# EasyEDA Pro project ProProject_SlimeVR AceStacks 16340_2024-07-12.epro

# Schematic AceStacks V1
Create Date: 2023-10-15; Page Name: P1; Project Name: SlimeVR AceStacks 16340; Schematic Name: AceStacks V1; Update Date: 2023-12-27; Company: 嘉立创EDA
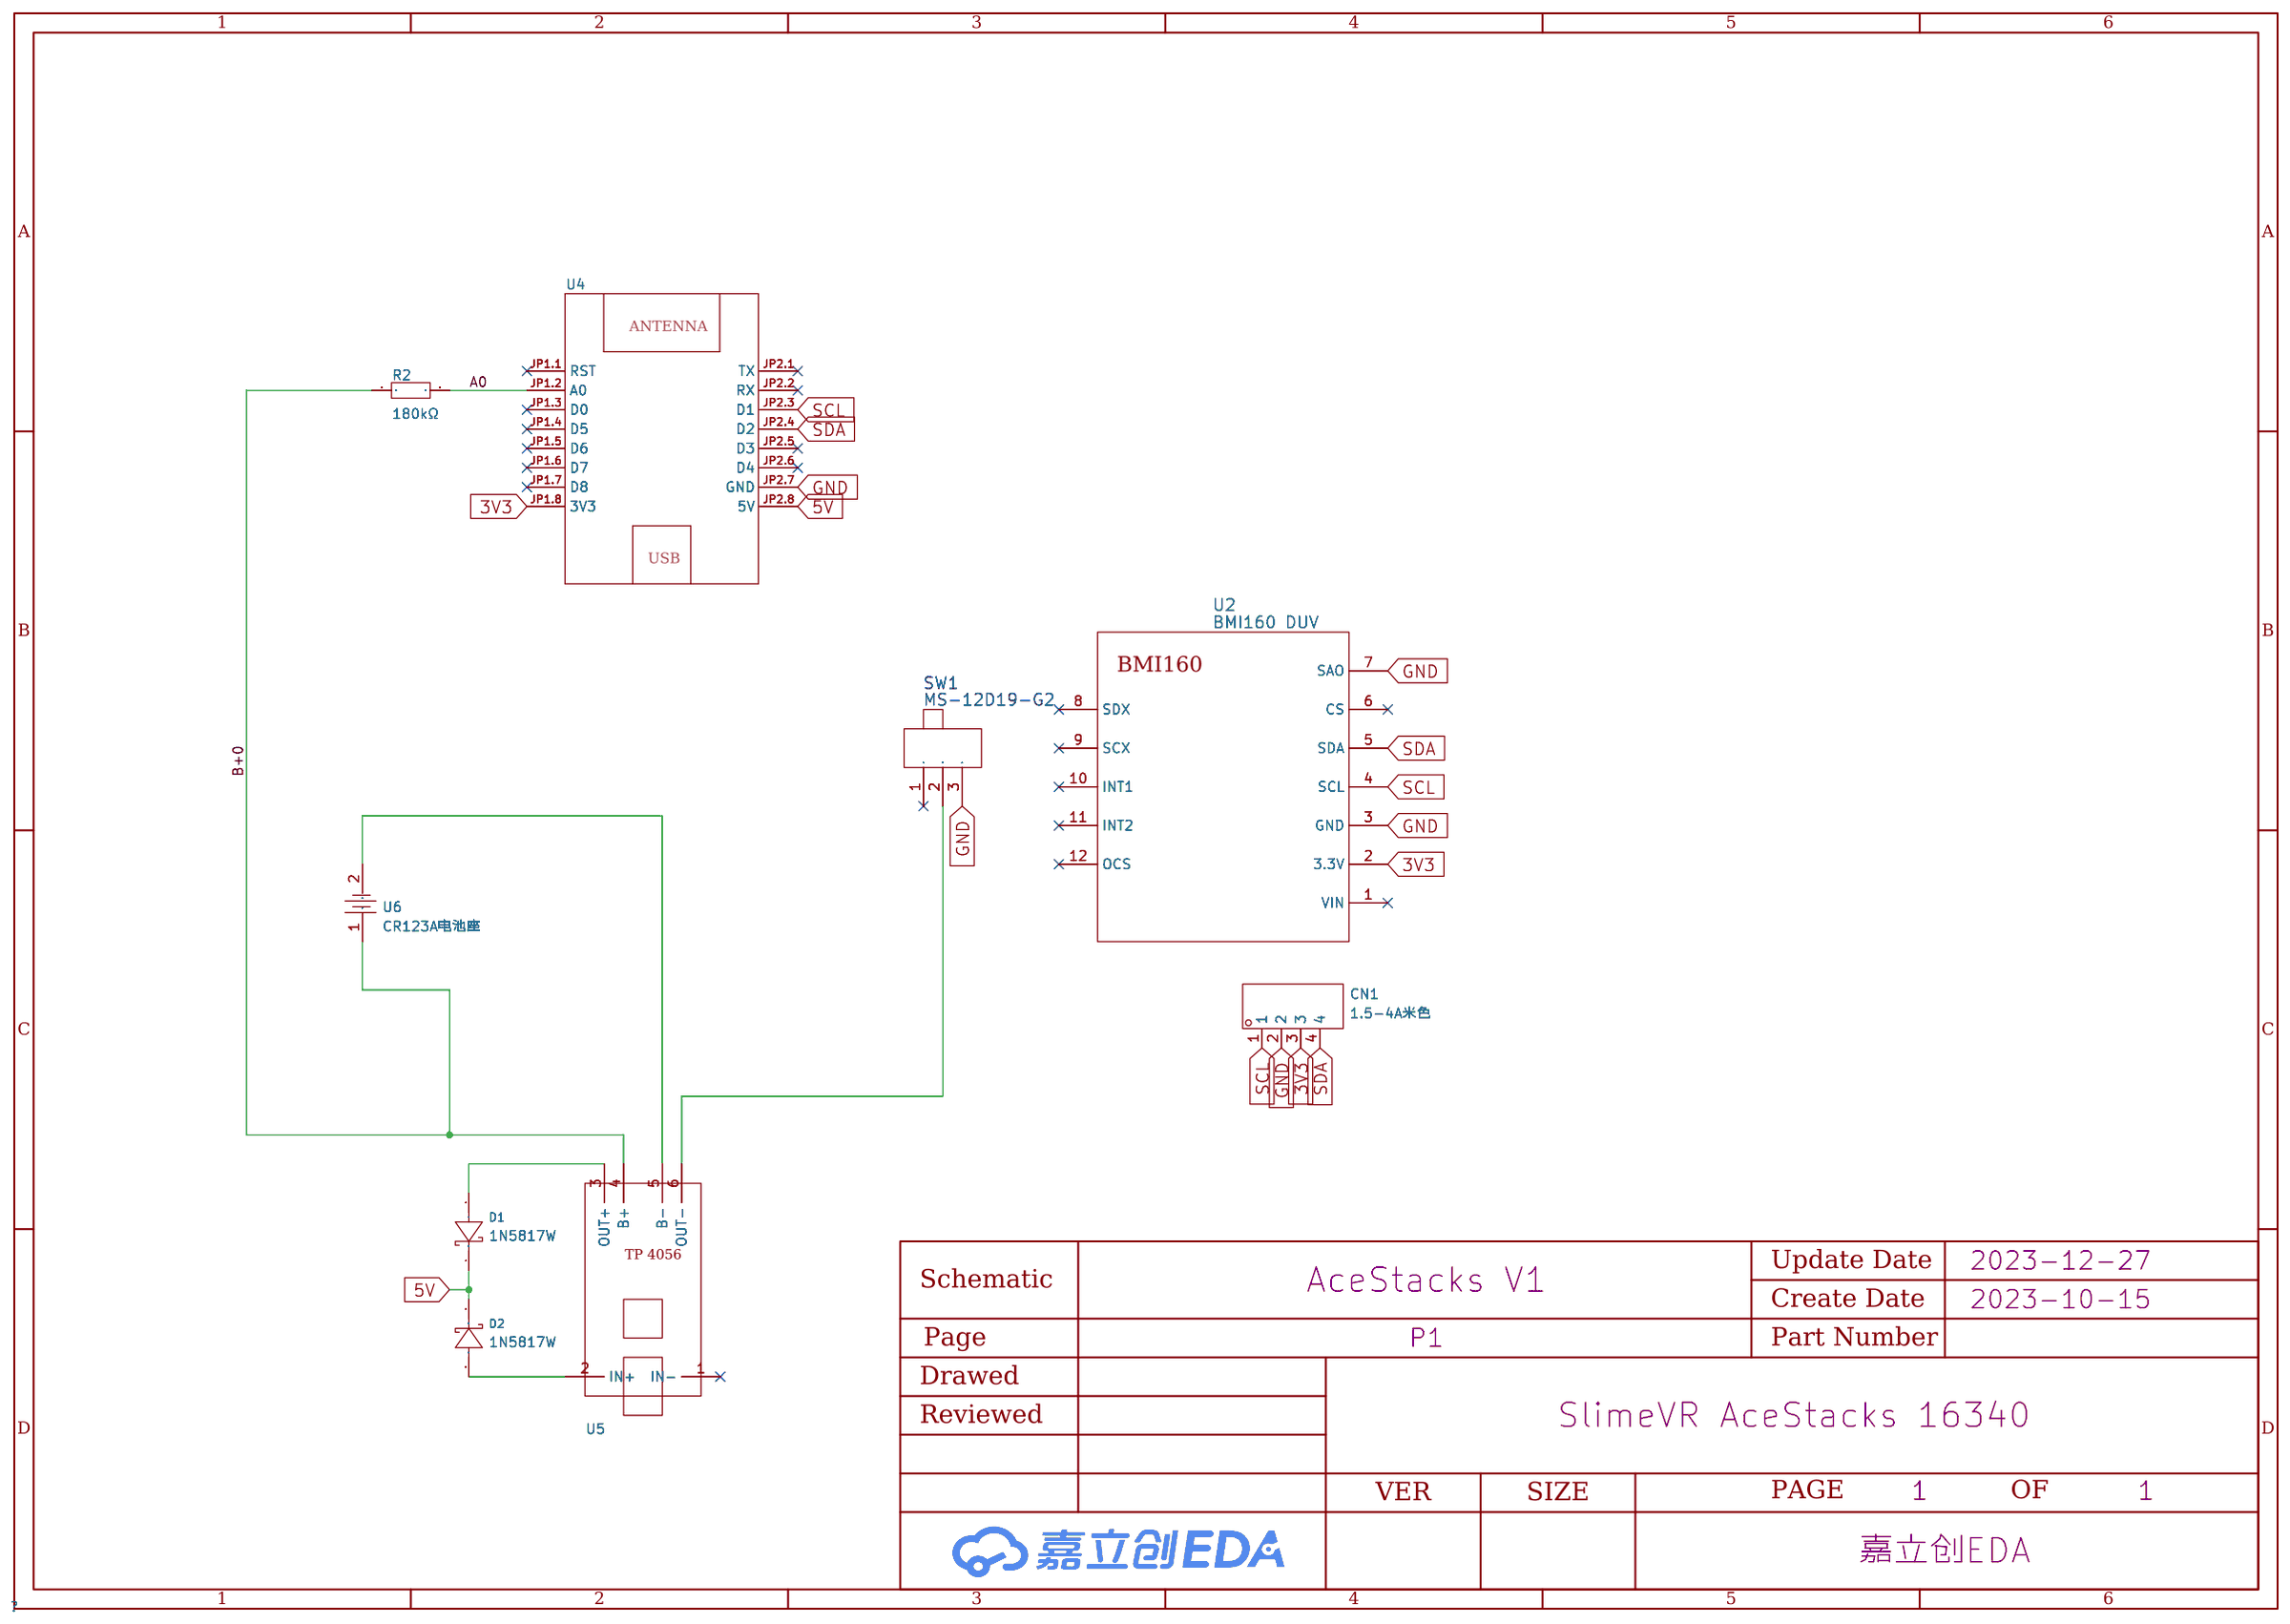
[diagram p0: schematic sheet]

## Parts
CN1  1.5-4A米色  [CONN-TH_4P-P1.50_ZH1.5-4A]
D1  1N5817W  [SOD-123_L2.8-W1.8-LS3.7-RD]
D2  1N5817W  [SOD-123_L2.8-W1.8-LS3.7-RD]
R2  180kΩ  [R1206]
SW1  MS-12D19-G2  [12d19g开关]
U2  BMI160 DUV  [GY-BMI160 DUV CORRECTED]
U4  -  [D1-MINI]
U5  -  [TP4056]
U6  CR123A电池座  [TH_L43.0-W-18.0-CR123A]

## Library data of the parts
CN1 = 1.5-4A米色: Reference Series:ZH Pitch:1.5mm Pins Structure:1x4P Number of Rows:1 Number of PINs Per Row:4 Row Spacing:- Mounting Style:- Contact Material:-; LCSC Part Name: ZH 1.5mm 1x4P; Supplier Part: C146011; Manufacturer: BOOMELE(博穆精密); Supplier Footprint: 插件,P=1.5mm; JLCPCB Part Class: Extended Part; Datasheet: https://atta.szlcsc.com/upload/public/pdf/source/20171115/C146011_15107293658451120495.pdf; Supplier: LCSC; Reference Series: ZH; Pitch: 1.5mm; Pins Structure: 1x4P; Number of Rows: 1; Number of PINs Per Row: 4
D1 D2 = 1N5817W: Diode Configuration:Single Forward Voltage (Vf@If):750mV@3A Reverse Voltage (Vr):20V Average Rectified Current (Io):1A Reverse Leakage Current (Ir):1mA@20V; LCSC Part Name: 电压:20V 电流:1A; Supplier Part: C727113; Manufacturer: TWGMC(台湾迪嘉); Supplier Footprint: SOD-123; JLCPCB Part Class: Extended Part; Datasheet: https://atta.szlcsc.com/upload/public/pdf/source/20200828/C727113_260B72EC53C389C21DF1E8AB243F1BFC.pdf; Supplier: LCSC; Diode Configuration: Single; Forward Voltage (Vf@If): 750mV@3A; Reverse Voltage (Vr): 20V; Average Rectified Current (Io): 1A; Reverse Leakage Current (Ir): 1mA@20V
R2 = Res_1206: Supplier Footprint: 1206
SW1 = MS-12D19-G2: Supplier: LCSC; Supplier Part: C2904913; Manufacturer: DEALON(德艺隆)
U2 = BMI160 DUV
U4 = D1-MINI
U5 = tp4056模块
U6 = CR123A电池座: Supplier Part: C2803347; Supplier Footprint: 插件; JLCPCB Part Class: Extended Part; Supplier: LCSC

## Nets
3V3: CN1.3 U2.2(3.3V) U4.JP1.8(3V3)
5V: D1.1(C) D2.1(C) U4.JP2.8(5V)
GND: CN1.2 SW1.3 U2.3(GND) U2.7(SAO) U4.JP2.7(GND)
A0: R2.2 U4.JP1.2(A0)
B+0: R2.1 U6.1
SCL: CN1.1 U2.4(SCL) U4.JP2.3(D1)
SDA: CN1.4 U2.5(SDA) U4.JP2.4(D2)

Not connected (* = marked no-connect by the designer): D1 2(A); D2 2(A); SW1 1* 2; U2 1(VIN)* 6(CS)* 8(SDX)* 9(SCX)* 10(INT1)* 11(INT2)* 12(OCS)*; U4 JP1.1(RST)* JP1.3(D0)* JP1.4(D5)* JP1.5(D6)* JP1.6(D7)* JP1.7(D8)* JP2.1(TX)* JP2.2(RX)* JP2.5(D3)* JP2.6(D4)*; U5 1(IN-)* 2(IN+) 3(OUT+) 4(B+) 5(B-) 6(OUT-); U6 2

# Schematic AceStacks V1_1
Create Date: 2024-02-04; Page Name: P1; Project Name: SlimeVR AceStacks 16340; Schematic Name: AceStacks V1_1; Update Date: 2024-02-21; Company: 嘉立创EDA
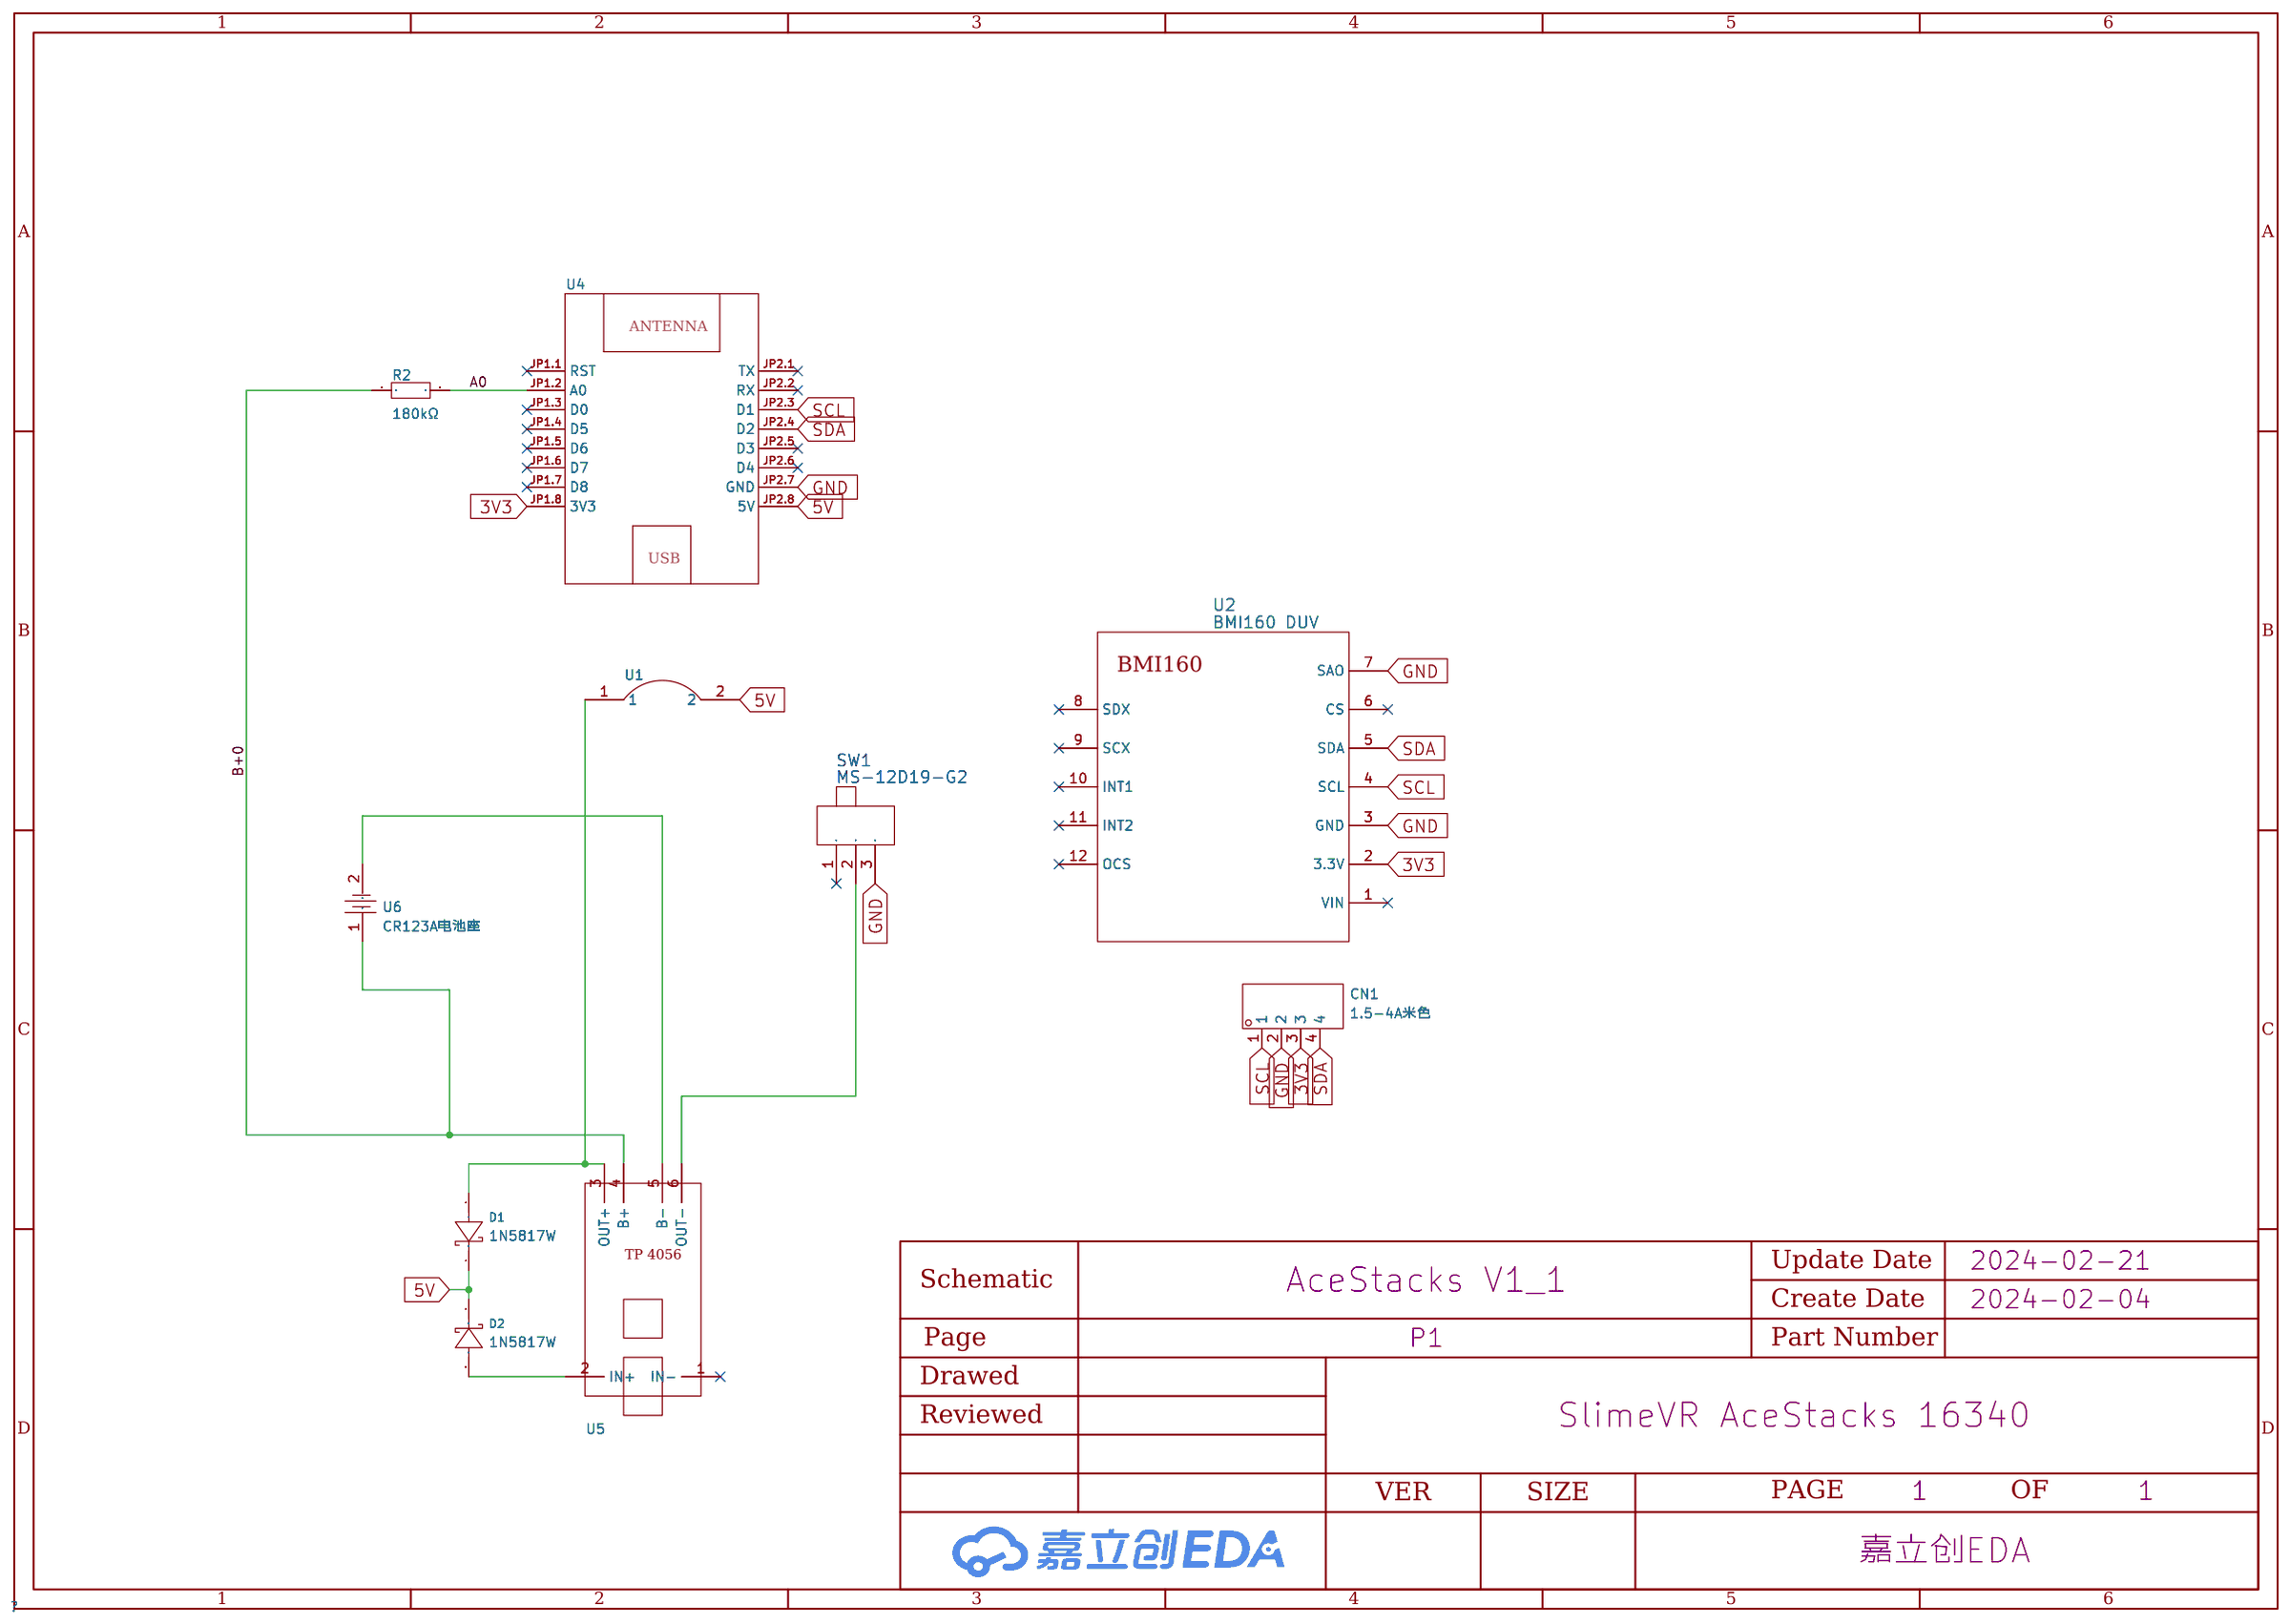
[diagram p1: schematic sheet]

## Parts
CN1  1.5-4A米色  [CONN-TH_4P-P1.50_ZH1.5-4A]
D1  1N5817W  [SOD-123_L2.8-W1.8-LS3.7-RD]
D2  1N5817W  [SOD-123_L2.8-W1.8-LS3.7-RD]
R2  180kΩ  [R1206]
SW1  MS-12D19-G2  [12d19g开关]
U1  -  [SolderJumper]
U2  BMI160 DUV  [GY-BMI160 DUV CORRECTED]
U4  -  [D1-MINI]
U5  -  [TP4056]
U6  CR123A电池座  [TH_L43.0-W-18.0-CR123A]

## Library data of the parts
CN1 = 1.5-4A米色: Reference Series:ZH Pitch:1.5mm Pins Structure:1x4P Number of Rows:1 Number of PINs Per Row:4 Row Spacing:- Mounting Style:- Contact Material:-; LCSC Part Name: ZH 1.5mm 1x4P; Supplier Part: C146011; Manufacturer: BOOMELE(博穆精密); Supplier Footprint: 插件,P=1.5mm; JLCPCB Part Class: Extended Part; Datasheet: https://atta.szlcsc.com/upload/public/pdf/source/20171115/C146011_15107293658451120495.pdf; Supplier: LCSC; Reference Series: ZH; Pitch: 1.5mm; Pins Structure: 1x4P; Number of Rows: 1; Number of PINs Per Row: 4
D1 D2 = 1N5817W: Diode Configuration:Single Forward Voltage (Vf@If):750mV@3A Reverse Voltage (Vr):20V Average Rectified Current (Io):1A Reverse Leakage Current (Ir):1mA@20V; LCSC Part Name: 电压:20V 电流:1A; Supplier Part: C727113; Manufacturer: TWGMC(台湾迪嘉); Supplier Footprint: SOD-123; JLCPCB Part Class: Extended Part; Datasheet: https://atta.szlcsc.com/upload/public/pdf/source/20200828/C727113_260B72EC53C389C21DF1E8AB243F1BFC.pdf; Supplier: LCSC; Diode Configuration: Single; Forward Voltage (Vf@If): 750mV@3A; Reverse Voltage (Vr): 20V; Average Rectified Current (Io): 1A; Reverse Leakage Current (Ir): 1mA@20V
R2 = Res_1206: Supplier Footprint: 1206
SW1 = MS-12D19-G2: Supplier: LCSC; Supplier Part: C2904913; Manufacturer: DEALON(德艺隆)
U1 = JUMPER SOLDER BRIDGE COPY COPY
U2 = BMI160 DUV
U4 = D1-MINI
U5 = tp4056模块
U6 = CR123A电池座: Supplier Part: C2803347; Supplier Footprint: 插件; JLCPCB Part Class: Extended Part; Supplier: LCSC

## Nets
3V3: CN1.3 U2.2(3.3V) U4.JP1.8(3V3)
5V: D1.1(C) D2.1(C) U1.2 U4.JP2.8(5V)
GND: CN1.2 SW1.3 U2.3(GND) U2.7(SAO) U4.JP2.7(GND)
A0: R2.2 U4.JP1.2(A0)
B+0: R2.1 U6.1
SCL: CN1.1 U2.4(SCL) U4.JP2.3(D1)
SDA: CN1.4 U2.5(SDA) U4.JP2.4(D2)
Net-(D1-2): D1.2(A) U1.1

Not connected (* = marked no-connect by the designer): D2 2(A); SW1 1* 2; U2 1(VIN)* 6(CS)* 8(SDX)* 9(SCX)* 10(INT1)* 11(INT2)* 12(OCS)*; U4 JP1.1(RST)* JP1.3(D0)* JP1.4(D5)* JP1.5(D6)* JP1.6(D7)* JP1.7(D8)* JP2.1(TX)* JP2.2(RX)* JP2.5(D3)* JP2.6(D4)*; U5 1(IN-)* 2(IN+) 3(OUT+) 4(B+) 5(B-) 6(OUT-); U6 2

# Schematic AceStacks V1_2
Create Date: 2023-10-15; Page Name: P1; Project Name: SlimeVR AceStacks 16340; Schematic Name: Kitkat SlimeVR 18650_5; Update Date: 2023-10-15; Company: 嘉立创EDA
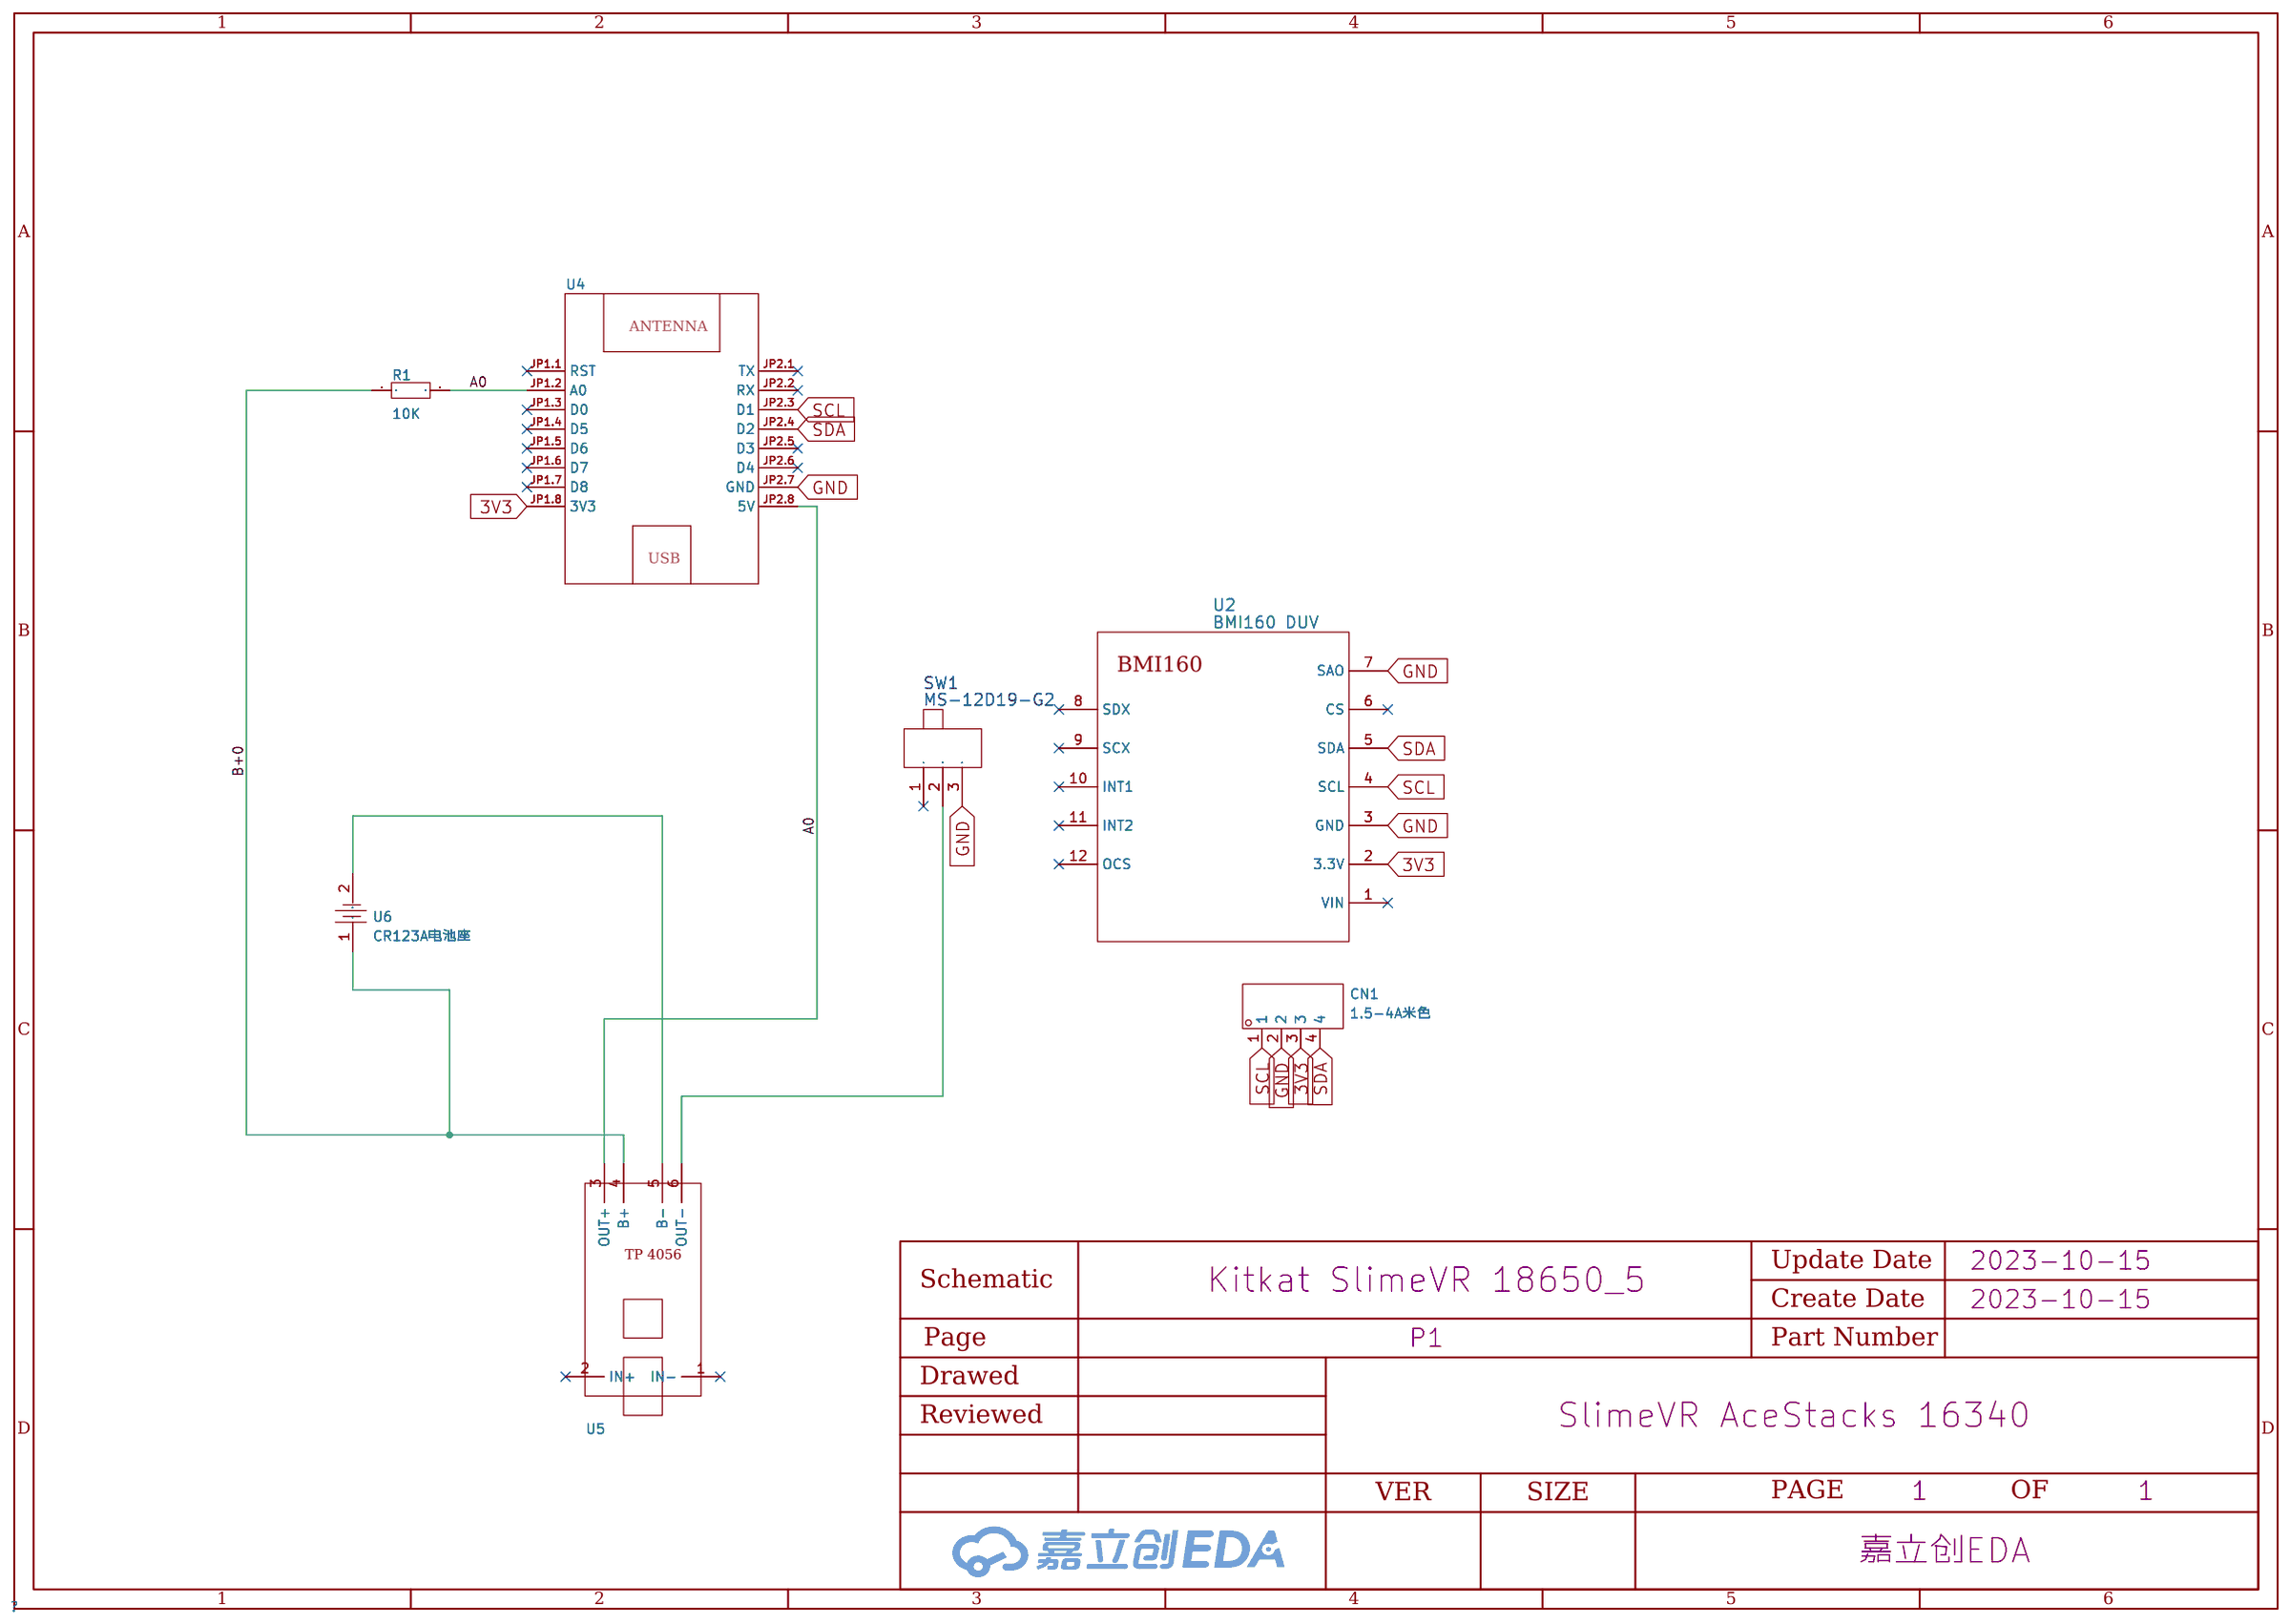
[diagram p2: schematic sheet]

## Parts
CN1  1.5-4A米色  [CONN-TH_4P-P1.50_ZH1.5-4A]
R1  10K  [R0805]
SW1  MS-12D19-G2  [12d19g开关]
U2  BMI160 DUV  [GY-BMI160 DUV CORRECTED]
U4  -  [D1-MINI]
U5  -  [TP4056]
U6  CR123A电池座  [TH_L43.0-W-18.0-CR123A]

## Library data of the parts
CN1 = 1.5-4A米色: Reference Series:ZH Pitch:1.5mm Pins Structure:1x4P Number of Rows:1 Number of PINs Per Row:4 Row Spacing:- Mounting Style:- Contact Material:-; LCSC Part Name: ZH 1.5mm 1x4P; Supplier Part: C146011; Manufacturer: BOOMELE(博穆精密); Supplier Footprint: 插件,P=1.5mm; JLCPCB Part Class: Extended Part; Datasheet: https://atta.szlcsc.com/upload/public/pdf/source/20171115/C146011_15107293658451120495.pdf; Supplier: LCSC; Reference Series: ZH; Pitch: 1.5mm; Pins Structure: 1x4P; Number of Rows: 1; Number of PINs Per Row: 4
R1 = Res_0805: Supplier Footprint: 0805
SW1 = MS-12D19-G2: Supplier: LCSC; Supplier Part: C2904913; Manufacturer: DEALON(德艺隆)
U2 = BMI160 DUV
U4 = D1-MINI
U5 = tp4056模块
U6 = CR123A电池座: Supplier Part: C2803347; Supplier Footprint: 插件; JLCPCB Part Class: Extended Part; Supplier: LCSC

## Nets
3V3: CN1.3 U2.2(3.3V) U4.JP1.8(3V3)
GND: CN1.2 SW1.3 U2.3(GND) U2.7(SAO) U4.JP2.7(GND)
A0: R1.2 U4.JP1.2(A0) U4.JP2.8(5V) U5.3(OUT+)
B+0: R1.1 U5.4(B+) U6.1
SCL: CN1.1 U2.4(SCL) U4.JP2.3(D1)
SDA: CN1.4 U2.5(SDA) U4.JP2.4(D2)
Net-(SW1-2): SW1.2 U5.6(OUT-)
Net-(U5-5): U5.5(B-) U6.2

Not connected (* = marked no-connect by the designer): SW1 1*; U2 1(VIN)* 6(CS)* 8(SDX)* 9(SCX)* 10(INT1)* 11(INT2)* 12(OCS)*; U4 JP1.1(RST)* JP1.3(D0)* JP1.4(D5)* JP1.5(D6)* JP1.6(D7)* JP1.7(D8)* JP2.1(TX)* JP2.2(RX)* JP2.5(D3)* JP2.6(D4)*; U5 1(IN-)* 2(IN+)*

# Schematic AceStacks V1_3
Create Date: 2024-02-21; Page Name: P1; Project Name: SlimeVR AceStacks 16340; Schematic Name: AceStacks V1_3; Update Date: 2024-02-21; Company: 嘉立创EDA
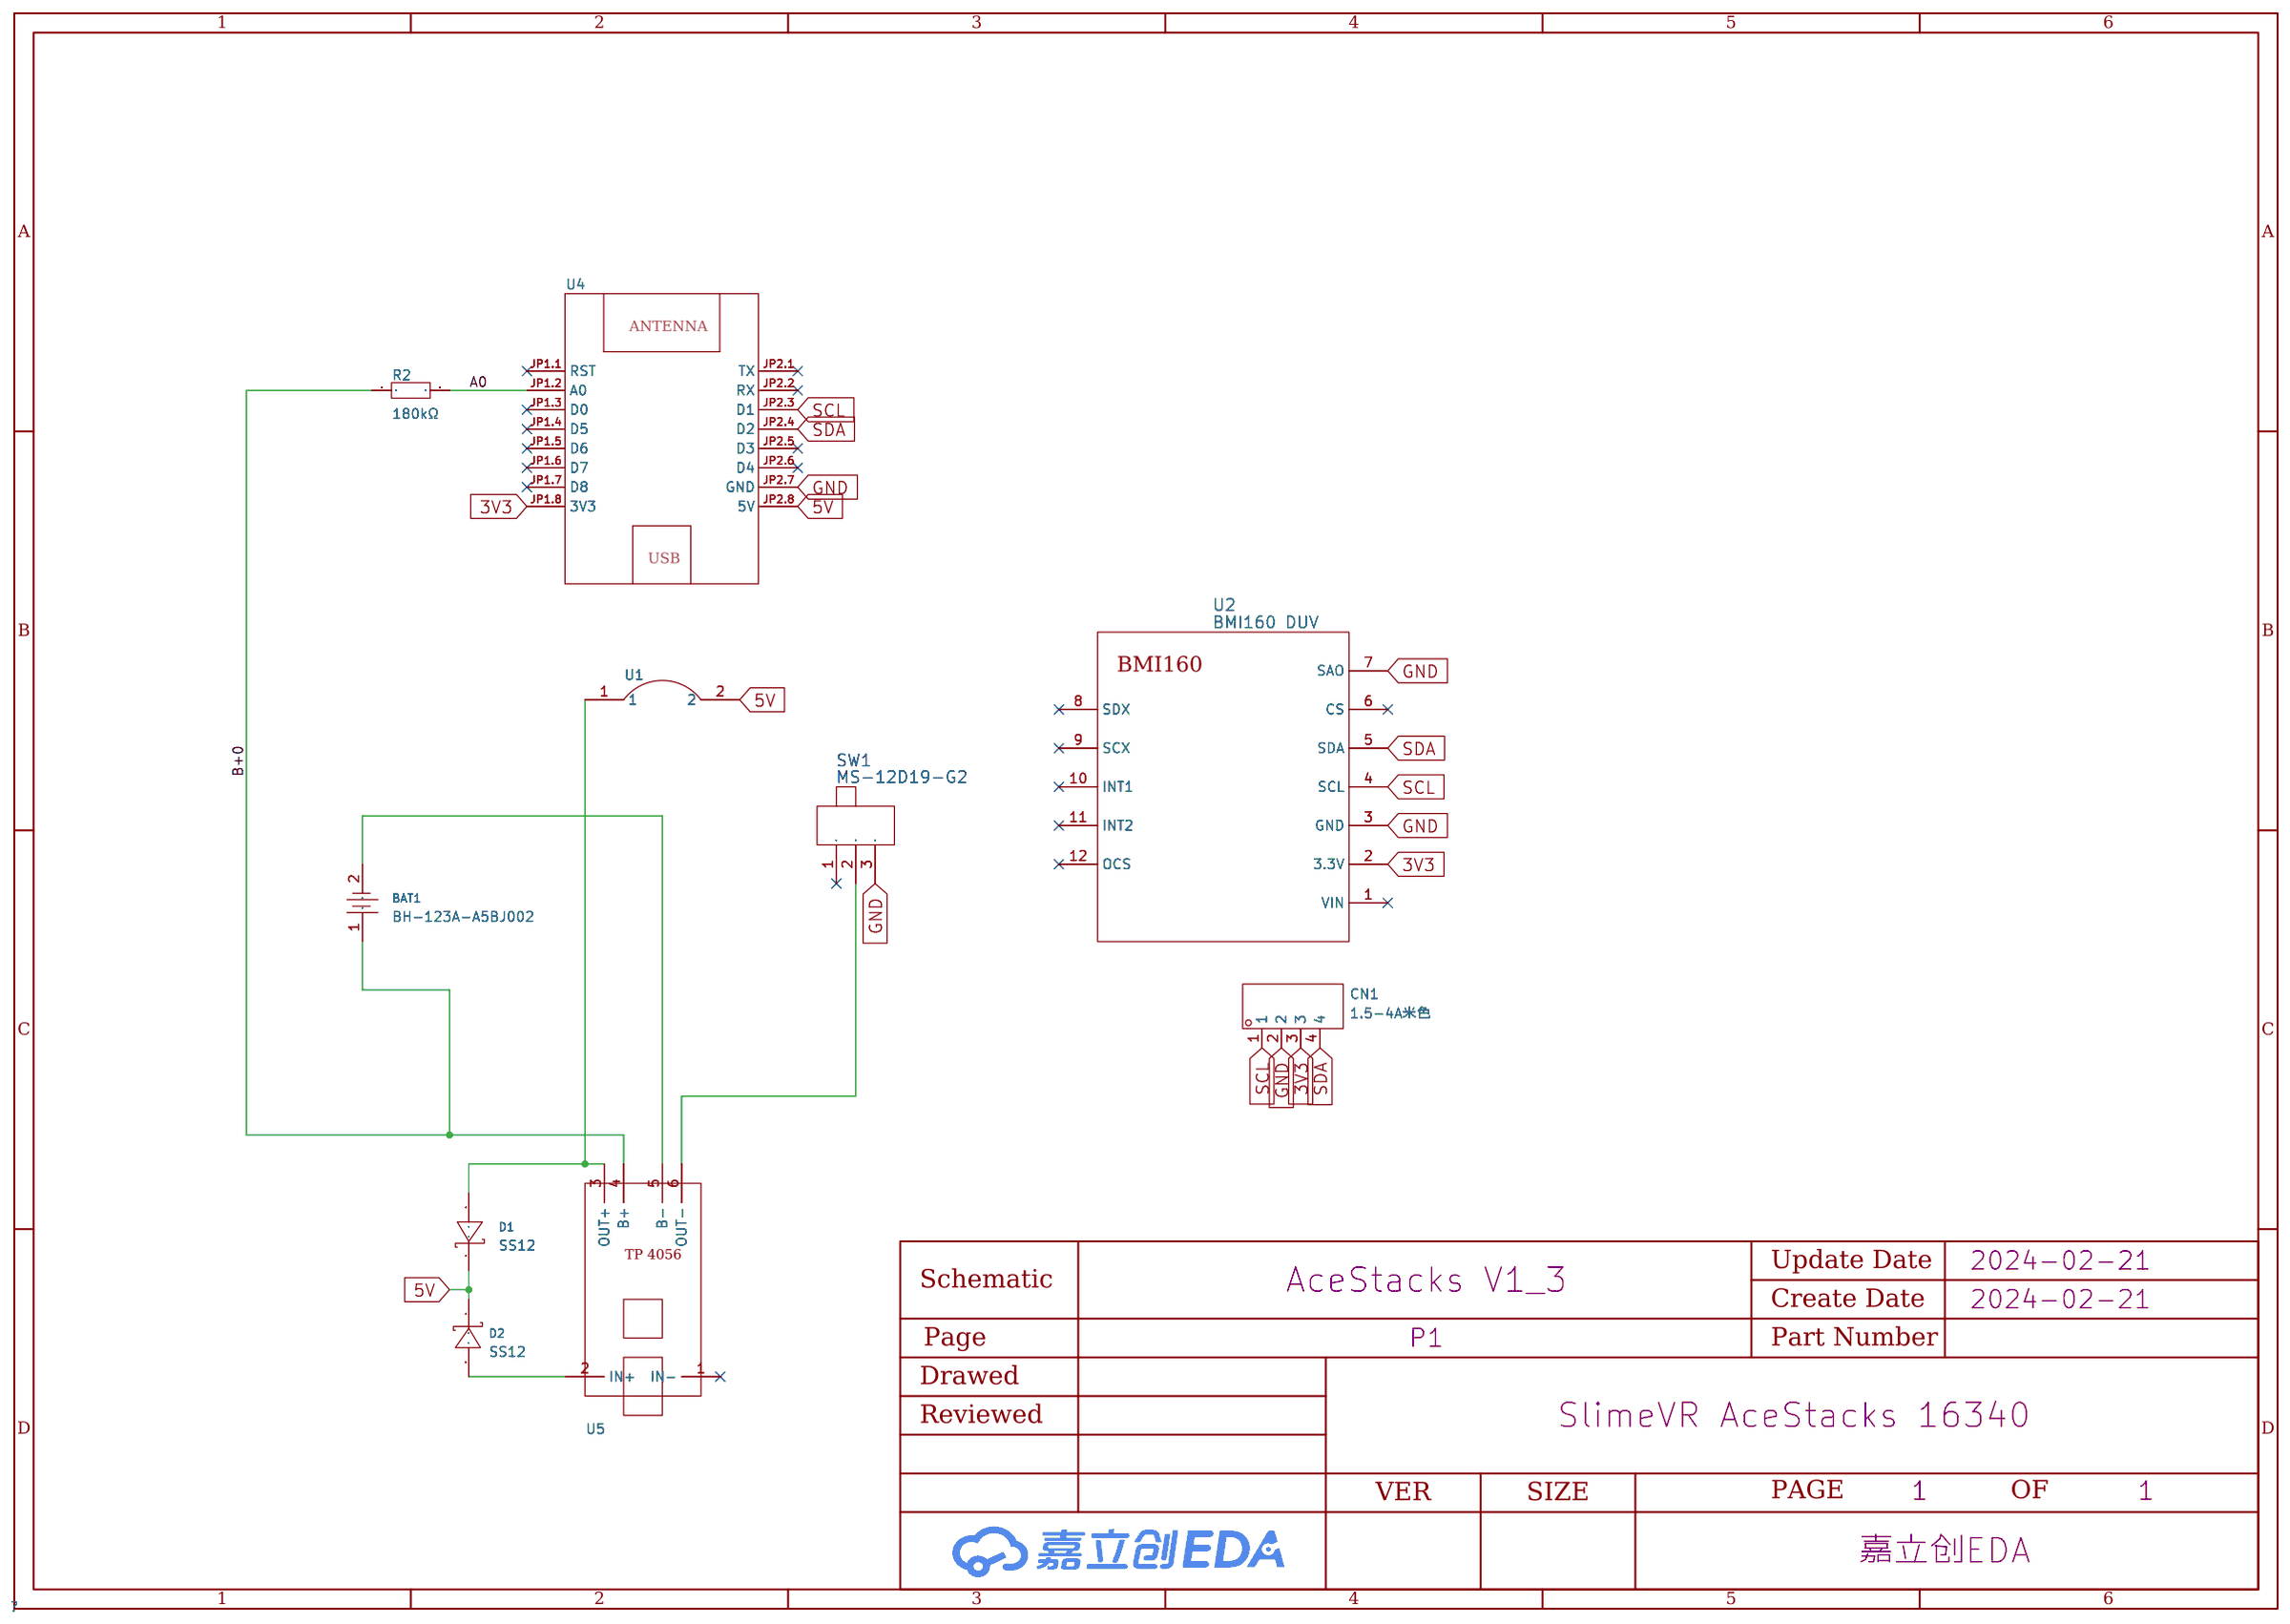
[diagram p3: schematic sheet]

## Parts
BAT1  BH-123A-A5BJ002  [BAT-TH_BH-123A-A5BJ002]
CN1  1.5-4A米色  [CONN-TH_4P-P1.50_ZH1.5-4A]
D1  SS12  [SMA_L4.3-W2.6-LS5.2-RD]
D2  SS12  [SMA_L4.3-W2.6-LS5.2-RD]
R2  180kΩ  [R1206]
SW1  MS-12D19-G2  [12d19g开关]
U1  -  [SolderJumper]
U2  BMI160 DUV  [GY-BMI160 DUV CORRECTED]
U4  -  [D1-MINI]
U5  -  [TP4056]

## Library data of the parts
BAT1 = BH-123A-A5BJ002: Connector Type:Battery case Battery Type:CR123A; LCSC Part Name: 电池盒 适用电池:CR123A; Supplier Part: C5290177; Manufacturer: MYOUNG(美阳); JLCPCB Part Class: Extended Part; Datasheet: https://atta.szlcsc.com/upload/public/pdf/source/20221129/C5DF5AE490C9EB9192DFF104AFD36393.pdf; Supplier: LCSC; Connector Type: Battery case; Battery Type: CR123A
CN1 = 1.5-4A米色: Reference Series:ZH Pitch:1.5mm Pins Structure:1x4P Number of Rows:1 Number of PINs Per Row:4 Row Spacing:- Mounting Style:- Contact Material:-; LCSC Part Name: ZH 1.5mm 1x4P; Supplier Part: C146011; Manufacturer: BOOMELE(博穆精密); Supplier Footprint: 插件,P=1.5mm; JLCPCB Part Class: Extended Part; Datasheet: https://atta.szlcsc.com/upload/public/pdf/source/20171115/C146011_15107293658451120495.pdf; Supplier: LCSC; Reference Series: ZH; Pitch: 1.5mm; Pins Structure: 1x4P; Number of Rows: 1; Number of PINs Per Row: 4
D1 D2 = SS12_C2479: Forward Voltage (Vf@If):550mV@1A Reverse Voltage (Vr):20V Average Rectified Current (Io):1A; LCSC Part Name: 电压:20V 电流:1A; Supplier Part: C2479; Manufacturer: MDD; Supplier Footprint: SMA(DO-214AC); JLCPCB Part Class: Extended Part; Datasheet: https://atta.szlcsc.com/upload/public/pdf/source/20230314/CB2C302F91CEFB8A73D1DF7B261C7D58.pdf; Supplier: LCSC; Forward Voltage (Vf@If): 550mV@1A; Reverse Voltage (Vr): 20V; Average Rectified Current (Io): 1A
R2 = Res_1206: Supplier Footprint: 1206
SW1 = MS-12D19-G2: Supplier: LCSC; Supplier Part: C2904913; Manufacturer: DEALON(德艺隆)
U1 = JUMPER SOLDER BRIDGE COPY COPY
U2 = BMI160 DUV
U4 = D1-MINI
U5 = tp4056模块

## Nets
3V3: CN1.3 U2.2(3.3V) U4.JP1.8(3V3)
5V: D1.1(K) D2.1(K) U1.2 U4.JP2.8(5V)
GND: CN1.2 SW1.3 U2.3(GND) U2.7(SAO) U4.JP2.7(GND)
A0: R2.2 U4.JP1.2(A0)
B+0: BAT1.1 R2.1
SCL: CN1.1 U2.4(SCL) U4.JP2.3(D1)
SDA: CN1.4 U2.5(SDA) U4.JP2.4(D2)
Net-(D1-2): D1.2(A) U1.1

Not connected (* = marked no-connect by the designer): BAT1 2; D2 2(A); SW1 1* 2; U2 1(VIN)* 6(CS)* 8(SDX)* 9(SCX)* 10(INT1)* 11(INT2)* 12(OCS)*; U4 JP1.1(RST)* JP1.3(D0)* JP1.4(D5)* JP1.5(D6)* JP1.6(D7)* JP1.7(D8)* JP2.1(TX)* JP2.2(RX)* JP2.5(D3)* JP2.6(D4)*; U5 1(IN-)* 2(IN+) 3(OUT+) 4(B+) 5(B-) 6(OUT-)

# Schematic AceStacksSMD
Create Date: 2023-10-24; Page Name: P1; Project Name: SlimeVR AceStacks 16340; Schematic Name: AceStacksSMD; Update Date: 2024-02-11; Company: 嘉立创EDA
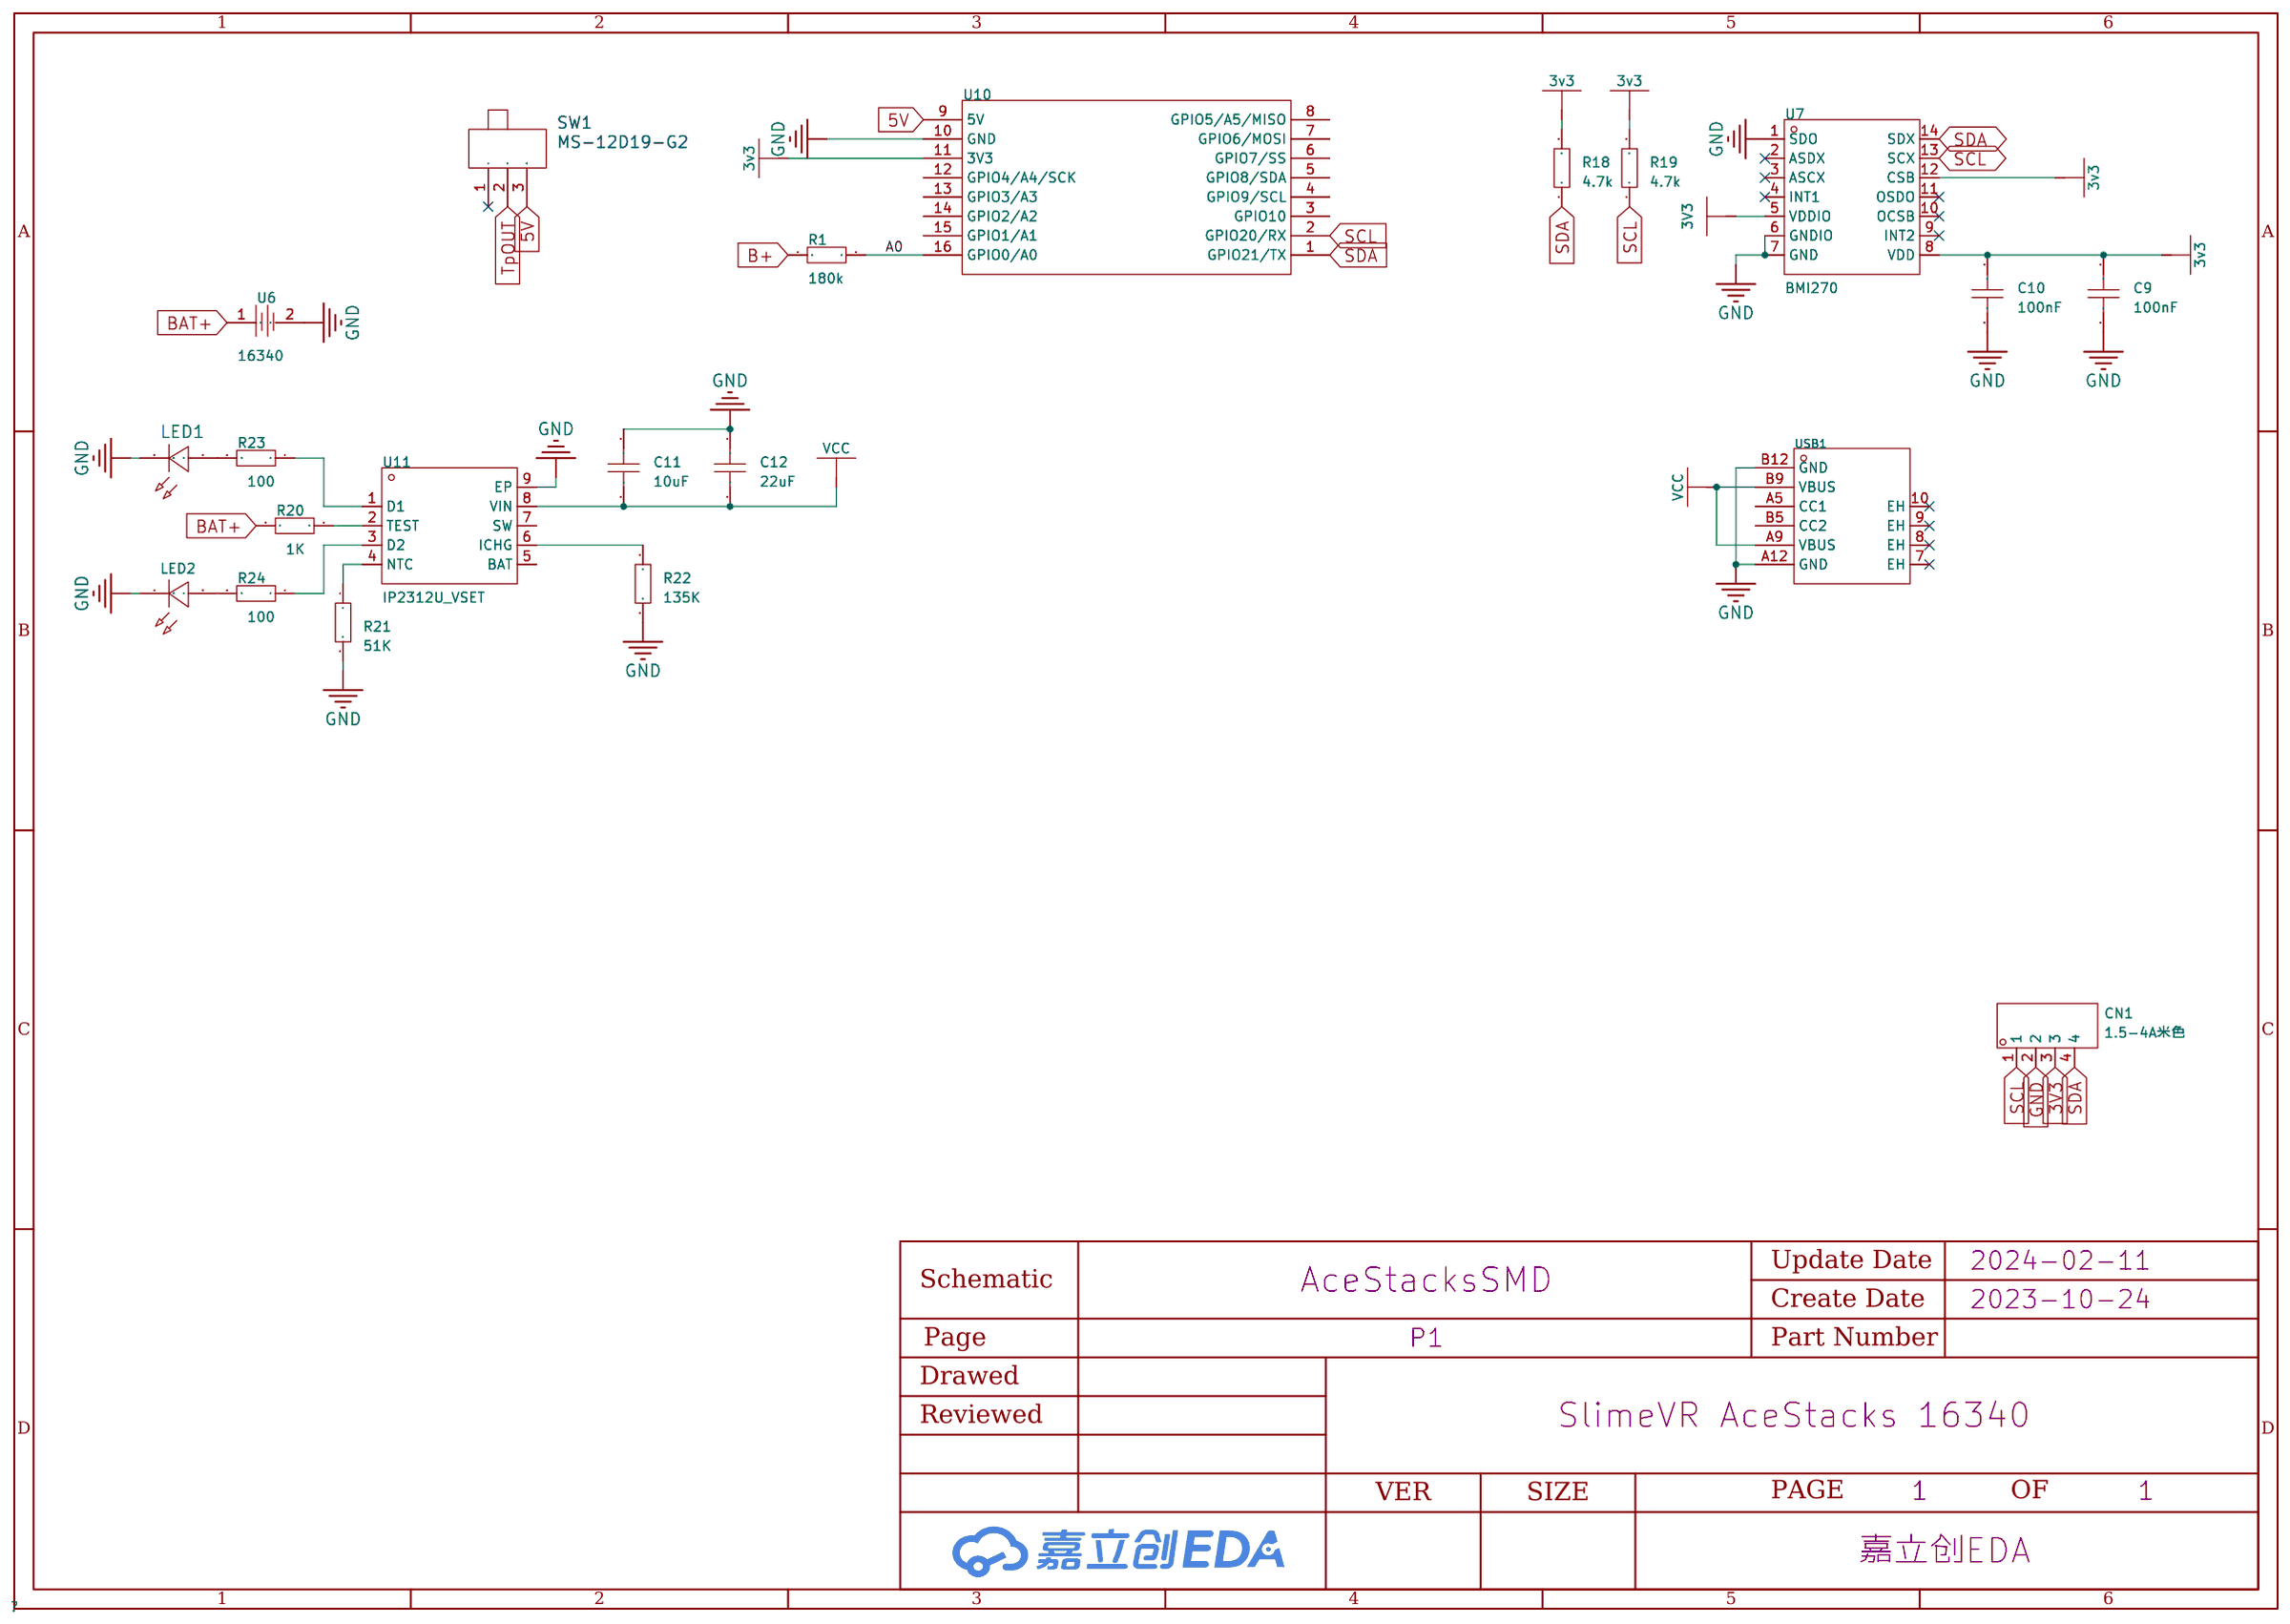
[diagram p4: schematic sheet]

## Parts
C9  100nF  [C0402]
C10  100nF  [C0402]
C11  10uF  [C0603]
C12  22uF  [C0603]
CN1  1.5-4A米色  [CONN-TH_4P-P1.50_ZH1.5-4A]
LED1  -  [LED0603-R-RD]
LED2  -  [LED0603-RD_GREEN]
R1  180k  [R0805]
R18  4.7k  [R0402]
R19  4.7k  [R0402]
R20  1K  [R0402]
R21  51K  [R0402]
R22  135K  [R0603]
R23  100  [R0402]
R24  100  [R0402]
SW1  MS-12D19-G2  [12d19g开关]
U6  16340  [TH_L43.0-W-18.0-CR123A]
U7  BMI270  [LGA-14_L3.0-W2.5-P0.50-BR]
U10  -  [ESP32-C3 SUPERMINI]
U11  IP2312U_VSET  [SOP-8_L4.9-W3.9-P1.27-LS6.0-BL-EP]
USB1  -  [USB-SMD_U262-061N-4BVC11]

## Library data of the parts
C9 C10 = CAP_0402: Supplier Part: C1525; Supplier Footprint: 0402
C11 C12 = CAP_0603: Supplier Footprint: 0603
CN1 = 1.5-4A米色: Reference Series:ZH Pitch:1.5mm Pins Structure:1x4P Number of Rows:1 Number of PINs Per Row:4 Row Spacing:- Mounting Style:- Contact Material:-; LCSC Part Name: ZH 1.5mm 1x4P; Supplier Part: C146011; Manufacturer: BOOMELE(博穆精密); Supplier Footprint: 插件,P=1.5mm; JLCPCB Part Class: Extended Part; Datasheet: https://atta.szlcsc.com/upload/public/pdf/source/20171115/C146011_15107293658451120495.pdf; Supplier: LCSC; Reference Series: ZH; Pitch: 1.5mm; Pins Structure: 1x4P; Number of Rows: 1; Number of PINs Per Row: 4
LED1 = LED_0603-R: Supplier Footprint: 0603
LED2 = LED_0603-G
R1 = Res_0805: Supplier Footprint: 0805
R18-R21 R23 R24 = Res_0402: Supplier Footprint: 0402
R22 = Res_0603: Supplier Footprint: 0603
SW1 = MS-12D19-G2: Supplier: LCSC; Supplier Part: C2904913; Manufacturer: DEALON(德艺隆)
U6 = CR123A电池座: Supplier Part: C2803347; Supplier Footprint: 插件; JLCPCB Part Class: Extended Part; Supplier: LCSC
U7 = BMI270: Supplier Part: C2836813; Manufacturer: Bosch(博世); Supplier Footprint: LGA-14(2.5x3); JLCPCB Part Class: Extended Part; Datasheet: https://atta.szlcsc.com/upload/public/pdf/source/20210625/C2836813_35E1F3F92097F45A3828DF13DDBA01A5.pdf; Supplier: LCSC
U10 = ESP32-C3 SuperMini: Supplier: AlieExpress
U11 = IP2312U_VSET: Supplier Part: C605432; Manufacturer: INJOINIC(英集芯); Supplier Footprint: SOP-8-EP; JLCPCB Part Class: Extended Part; Datasheet: https://atta.szlcsc.com/upload/public/pdf/source/20200908/C605432_A60BD6D88F2FAE4109BDCDD377258269.pdf; Supplier: LCSC
USB1 = USB_ TYPE-C-6P: Supplier Footprint: Through

## Nets
3V3: CN1.3 U7.5(VDDIO)
3v3: C9.1 C10.1 R18.2 R19.2 U7.8(VDD) U7.12(CSB) U10.11(3V3)
5V: SW1.3 U10.9(5V)
GND: C9.2 C10.2 C11.1 C12.1 CN1.2 LED1.2(C) LED2.1(C) R21.2 R22.2 U6.2 U7.1(SDO) U7.6(GNDIO) U7.7(GND) U10.10(GND) U11.9(EP) USB1.A12(GND) USB1.B12(GND)
VCC: C11.2 C12.2 U11.8(VIN) USB1.A9(VBUS) USB1.B9(VBUS)
A0: R1.2 U10.16(GPIO0/A0)
B+: R1.1
BAT+: R20.2 U6.1
SCL: CN1.1 R19.1 U7.13(SCX) U10.2(GPIO20/RX)
SDA: CN1.4 R18.1 U7.14(SDX) U10.1(GPIO21/TX)
TpOUT: SW1.2
$1N8921: R20.1 U11.2(TEST)
$1N8966: R21.1 U11.4(NTC)
$1N10747: R22.1 U11.6(ICHG)
$1N10937: LED1.1(A) R23.2
$1N10987: LED2.2(A) R24.2
$1N10991: R23.1 U11.1(D1)
$1N10995: R24.1 U11.3(D2)

Not connected (* = marked no-connect by the designer): SW1 1*; U7 2(ASDX)* 3(ASCX)* 4(INT1)* 9(INT2)* 10(OCSB)* 11(OSDO)*; U10 3(GPIO10) 4(GPIO9/SCL) 5(GPIO8/SDA) 6(GPIO7/SS) 7(GPIO6/MOSI) 8(GPIO5/A5/MISO) 12(GPIO4/A4/SCK) 13(GPIO3/A3) 14(GPIO2/A2) 15(GPIO1/A1); U11 5(BAT) 7(SW); USB1 7(EH)* 8(EH)* 9(EH)* 10(EH)* A5(CC1) B5(CC2)

# Schematic IP2312 Li-Ion Charger
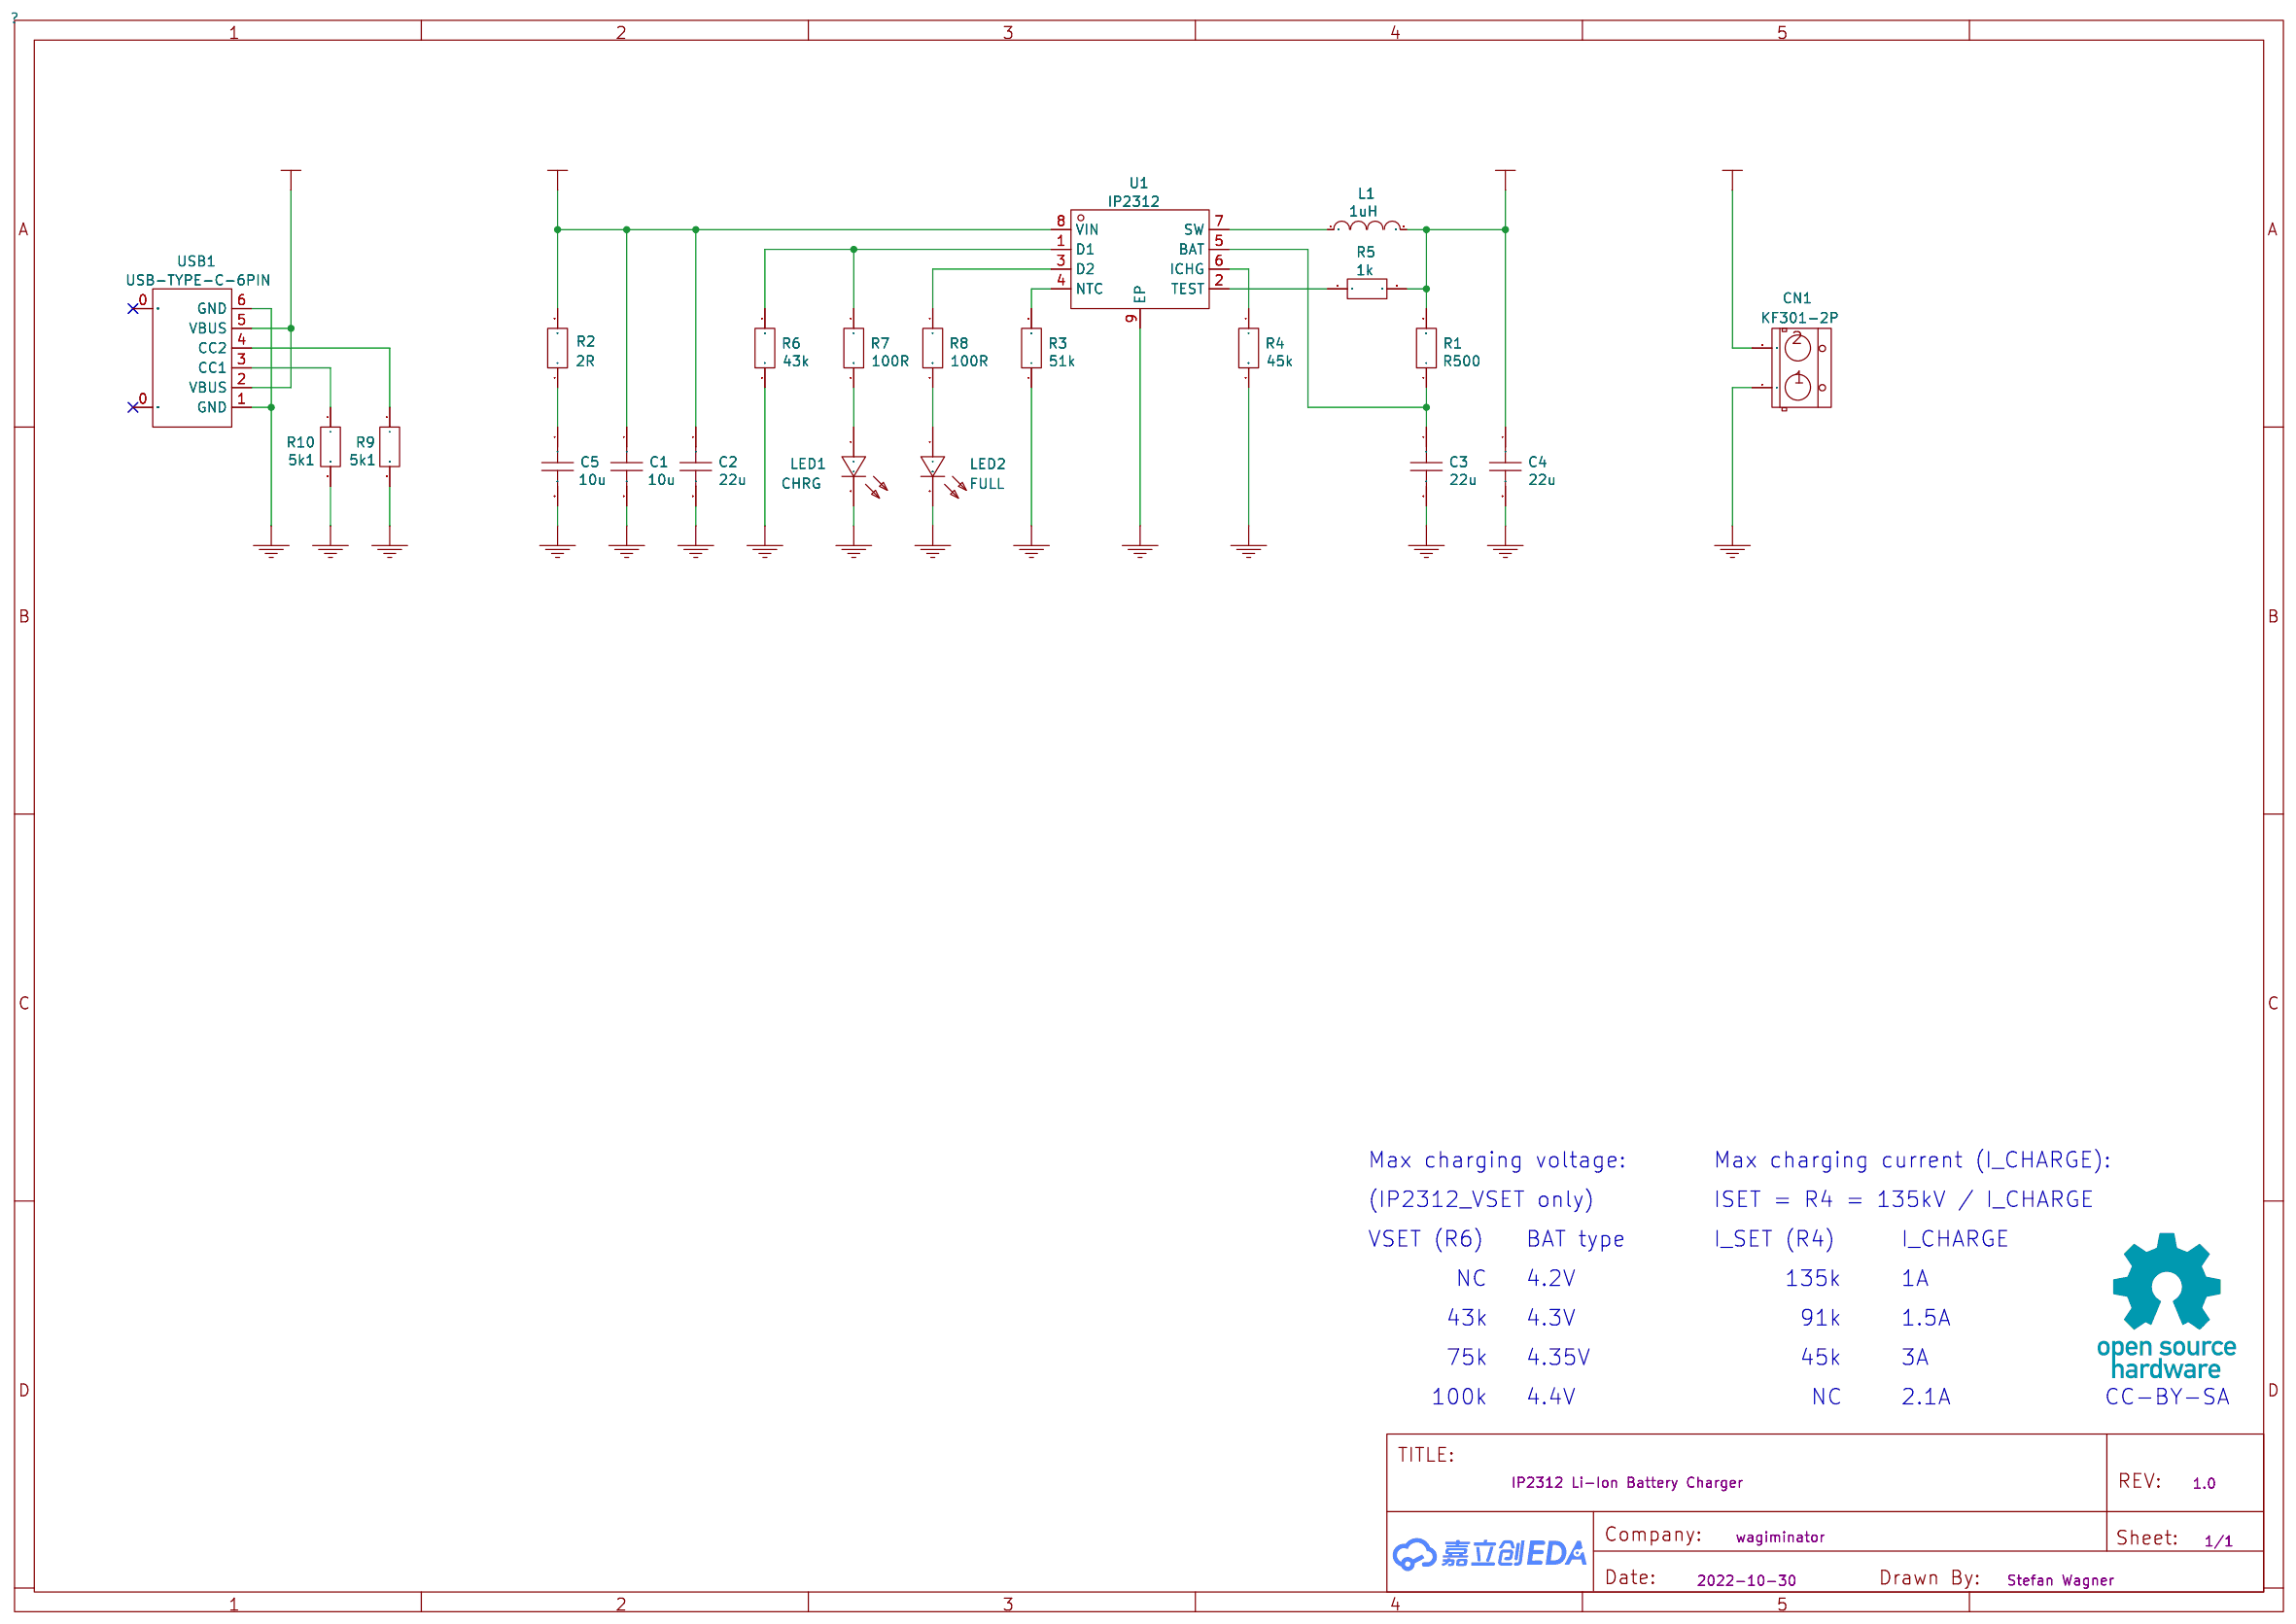
[diagram p5: schematic sheet]

## Parts
C1  10u
C2  22u
C3  22u
C4  22u
C5  10u
CN1  KF301-2P
L1  1uH
LED1  CHRG
LED2  FULL
R1  R500
R2  2R
R3  51k
R4  45k
R5  1k
R6  43k
R7  100R
R8  100R
R9  5k1
R10  5k1
U1  IP2312
USB1  USB-TYPE-C-6PIN

## Library data of the parts
C1 C5 = 10u: Supplier: LCSC; Manufacturer: SAMSUNG; Manufacturer Part: CL10A106KP8NNNC; Supplier Part: C19702; JLCPCB Part Class: Basic Part
C2-C4 = 22u: Supplier: LCSC; Manufacturer: MuRata; Manufacturer Part: GRM188R60J226MEA0D; Supplier Part: C77042; JLCPCB Part Class: Basic Part
CN1 = KF301-2P: Manufacturer Part: KF301-5.0-2P; Supplier: LCSC; Manufacturer: Cixi Kefa Elec; Supplier Part: C474881
L1 = 1uH: Supplier: LCSC; Manufacturer: Prosperity Dielectrics; Manufacturer Part: MCS0630-1R0MN2; Supplier Part: C385251
LED1 = CHRG: Supplier: LCSC; Manufacturer: KENTO; Manufacturer Part: KT-0603R; image: //image.lceda.cn/szlcsc/C2286.jpg; Supplier Part: C2286; JLCPCB Part Class: Basic
LED2 = FULL: Supplier: LCSC; Manufacturer: EVERLIGHT; Manufacturer Part: 19-217/GHC-YR1S2/3T; image: //image.lceda.cn/szlcsc/C72043.jpg; Supplier Part: C72043; JLCPCB Part Class: Basic
R1 = R500: Manufacturer Part: FRL0603JR500TS; Supplier: LCSC; Manufacturer: FOJAN; Supplier Part: C2930046
R2 = 2R: Manufacturer Part: 0603WAJ020JT5E; Supplier: LCSC; Manufacturer: UniOhm; Supplier Part: C25225
R3 = 51k: Manufacturer Part: 0603WAF5102T5E; Supplier: LCSC; Manufacturer: UniOhm; Supplier Part: C23196
R4 = 45k: Manufacturer Part: 0603WAF4532T5E; Supplier: LCSC; Manufacturer: UniOhm; Supplier Part: C23058
R5 = 1k: Manufacturer Part: 0603WAF1001T5E; Supplier: LCSC; Manufacturer: UNI-ROYAL(厚声); Supplier Part: C21190
R6 = 43k: Manufacturer Part: 0603WAF4302T5E; Supplier: LCSC; Manufacturer: UNI-ROYAL(厚声); Supplier Part: C23172
R7 R8 = 100R: Manufacturer Part: 0603WAF1000T5E; Supplier: LCSC; Manufacturer: UNI-ROYAL(厚声); Supplier Part: C22775
R9 R10 = 5k1: Manufacturer Part: 0603WAF5101T5E; Supplier: LCSC; Manufacturer: UniOhm; Supplier Part: C23186
U1 = IP2312: Supplier: LCSC; Supplier Part: C605432; Manufacturer: INJOINIC(英集芯); Manufacturer Part: IP2312U_VSET; JLCPCB Part Class: Extended Part
USB1 = USB-TYPE-C-6PIN: Supplier: LCSC; Supplier Part: C283540; Manufacturer: Korean Hroparts Elec; Manufacturer Part: TYPE-C-31-M-17

## Nets
GND: C1.2 C2.2 C3.2 C4.2 C5.2 CN1.1 LED1.2(K) LED2.2(C) R3.1 R4.2 R6.2 R9.2 R10.2 U1.9(EP) USB1.1(GND) USB1.6(GND)
VBAT: C4.1 CN1.2 L1.2 R1.2 R5.2
VIN: C1.1 C2.1 R2.2 U1.8(VIN) USB1.2(VBUS) USB1.5(VBUS)
Net-(C3-1): C3.1 R1.1 U1.5(BAT)
Net-(C5-1): C5.1 R2.1
Net-(L1-1): L1.1 U1.7(SW)
Net-(LED1-1): LED1.1(A) R7.2
Net-(LED2-1): LED2.1(A) R8.2
Net-(R3-2): R3.2 U1.4(NTC)
Net-(R4-1): R4.1 U1.6(ICHG)
Net-(R5-1): R5.1 U1.2(TEST)
Net-(R6-1): R6.1 R7.1 U1.1(D1)
Net-(R8-1): R8.1 U1.3(D2)
Net-(R9-1): R9.1 USB1.4(CC2)
Net-(R10-1): R10.1 USB1.3(CC1)

Not connected (* = marked no-connect by the designer): USB1 0(SHIELD)*

## Notes on the sheet
- Max charging voltage:
- Max charging current (I_CHARGE):
- (IP2312_VSET only)
- ISET = R4 = 135kV / I_CHARGE
- VSET (R6)
- BAT type
- I_SET (R4)
- I_CHARGE
- NC
- 4.2V
- 135k
- 1A
- 43k
- 4.3V
- 91k
- 1.5A
- 75k
- 4.35V
- 45k
- 3A
- 100k
- 4.4V
- NC
- 2.1A
- CC-BY-SA

# Schematic Kitkat SlimeVR 16340_1
Create Date: 2023-03-20; Page Name: P1; Project Name: Kitkat SlimeVR 18650; Schematic Name: Kitkat SlimeVR 18650; Update Date: 2023-08-21; Company: 嘉立创EDA
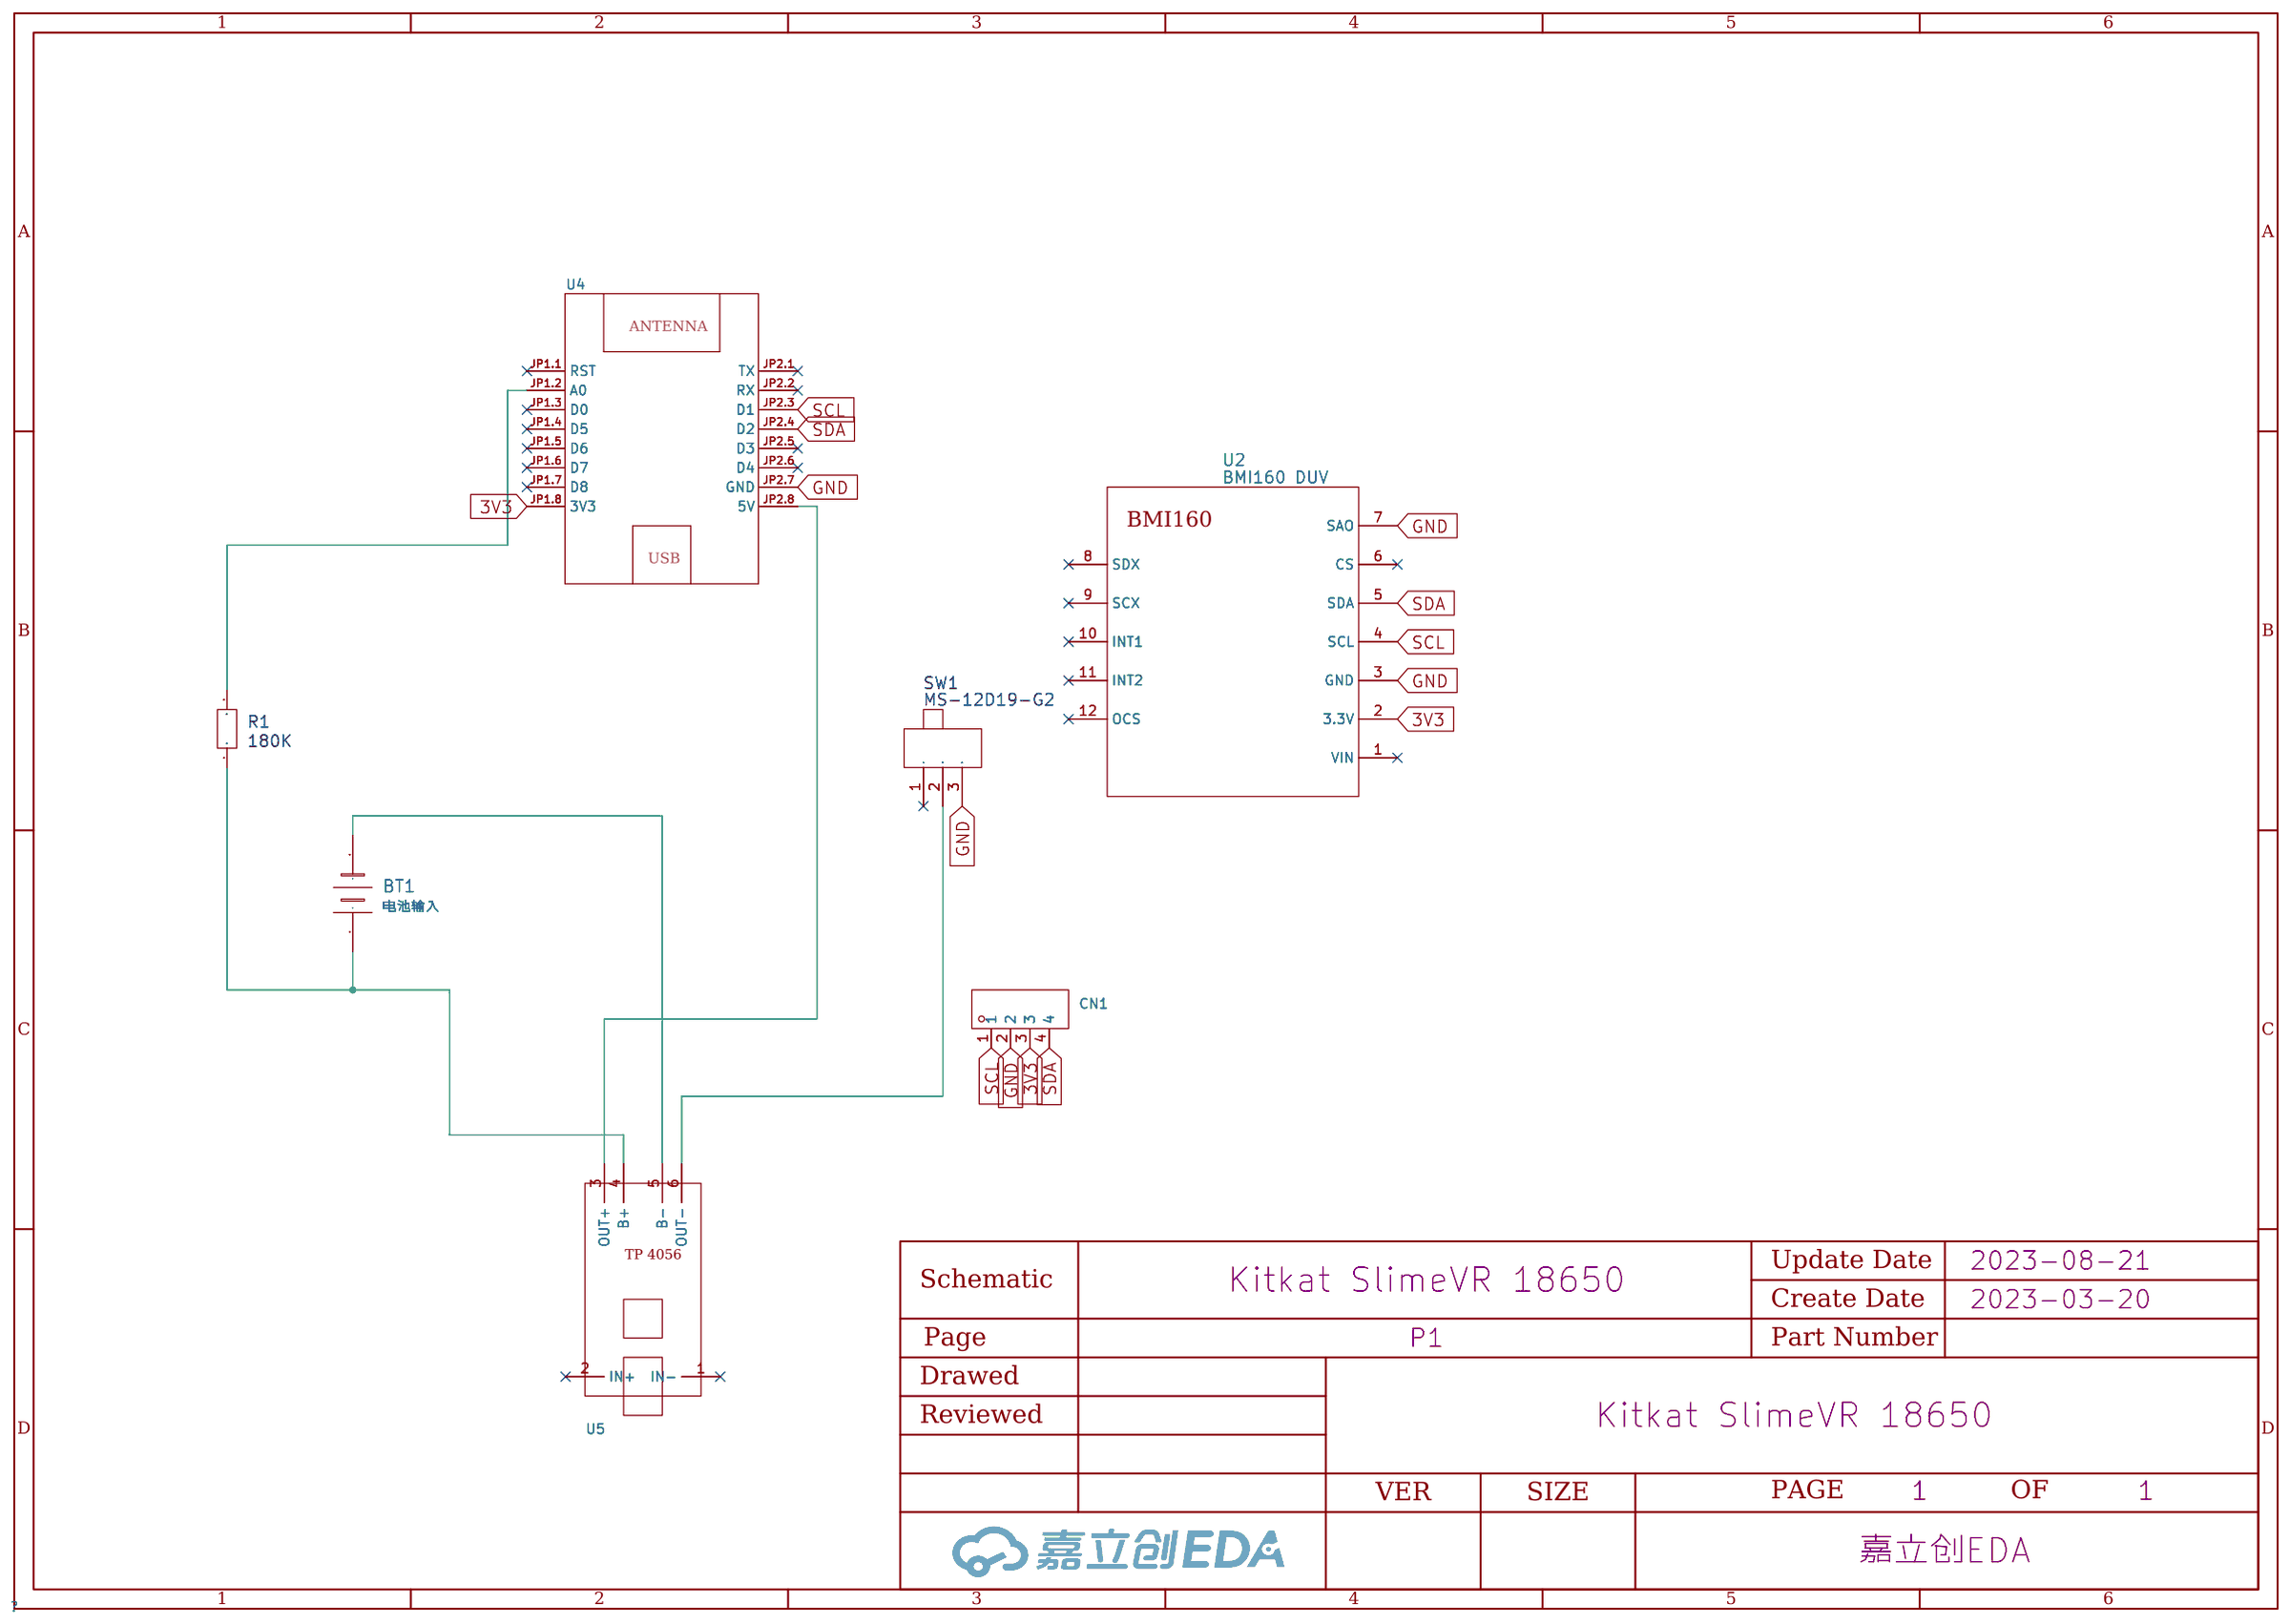
[diagram p6: schematic sheet]

## Parts
BT1  电池输入  [18650]
CN1  -  [CONN-TH_4P-P2.00_KINGHELM_KH-PH-4P-W]
R1  180K  [RES-TH_BD2.4-L6.3-P10.30-D0.6]
SW1  MS-12D19-G2  [12d19g开关]
U2  BMI160 DUV  [GY-BMI160 DUV CORRECTED]
U4  -  [D1-MINI]
U5  -  [TP4056]

## Library data of the parts
BT1 = 3.7V
CN1 = PH2.00-4P-立贴: Supplier Part: C146095; Manufacturer: BOOMELE(博穆精密); Manufacturer Part: PH-4AW米; LCSC On Sale: 1; Supplier Footprint: 卧插 P=2mm; JLCPCB Part Class: Extended Part; JLCPCB Stock Number: 4500; Datasheet: https://atta.szlcsc.com/upload/public/pdf/source/20171115/C146095_15107294042951120572.pdf; Supplier: LCSC; Number of Positions: 4; Connector Type: 针座; Number of Rows: 1; Mounting Type: 通孔,直角; Contact Type: 公形引脚; Pitch: 0.079; Series: PH
R1 = RN 1/4W 180K F T/B A1: Supplier: LCSC; Supplier Part: C410667; Manufacturer: TyoHM; JLCPCB Part Class: Extended Part; Resistance: 180kΩ
SW1 = MS-12D19-G2: Supplier: LCSC; Supplier Part: C2904913; Manufacturer: DEALON(德艺隆)
U2 = BMI160 DUV
U4 = D1-MINI
U5 = tp4056模块

## Nets
3V3: CN1.3 U2.2(3.3V) U4.JP1.8(3V3)
GND: CN1.2 SW1.3 U2.3(GND) U2.7(SAO) U4.JP2.7(GND)
SCL: CN1.1 U2.4(SCL) U4.JP2.3(D1)
SDA: CN1.4 U2.5(SDA) U4.JP2.4(D2)
$1N942: SW1.2 U5.6(OUT-)
$1N944: R1.2 U4.JP1.2(A0)
$1N945: BT1.1(+) R1.1 U5.4(B+)
$1N946: BT1.2(-) U5.5(B-)
$1N1593: U4.JP2.8(5V) U5.3(OUT+)

Not connected (* = marked no-connect by the designer): SW1 1*; U2 1(VIN)* 6(CS)* 8(SDX)* 9(SCX)* 10(INT1)* 11(INT2)* 12(OCS)*; U4 JP1.1(RST)* JP1.3(D0)* JP1.4(D5)* JP1.5(D6)* JP1.6(D7)* JP1.7(D8)* JP2.1(TX)* JP2.2(RX)* JP2.5(D3)* JP2.6(D4)*; U5 1(IN-)* 2(IN+)*

# Schematic Kitkat SlimeVR 18650_2
Create Date: 2023-09-06; Page Name: P1; Project Name: Kitkat SlimeVR 18650; Schematic Name: Kitkat SlimeVR 18650_2; Update Date: 2023-09-06; Company: 嘉立创EDA
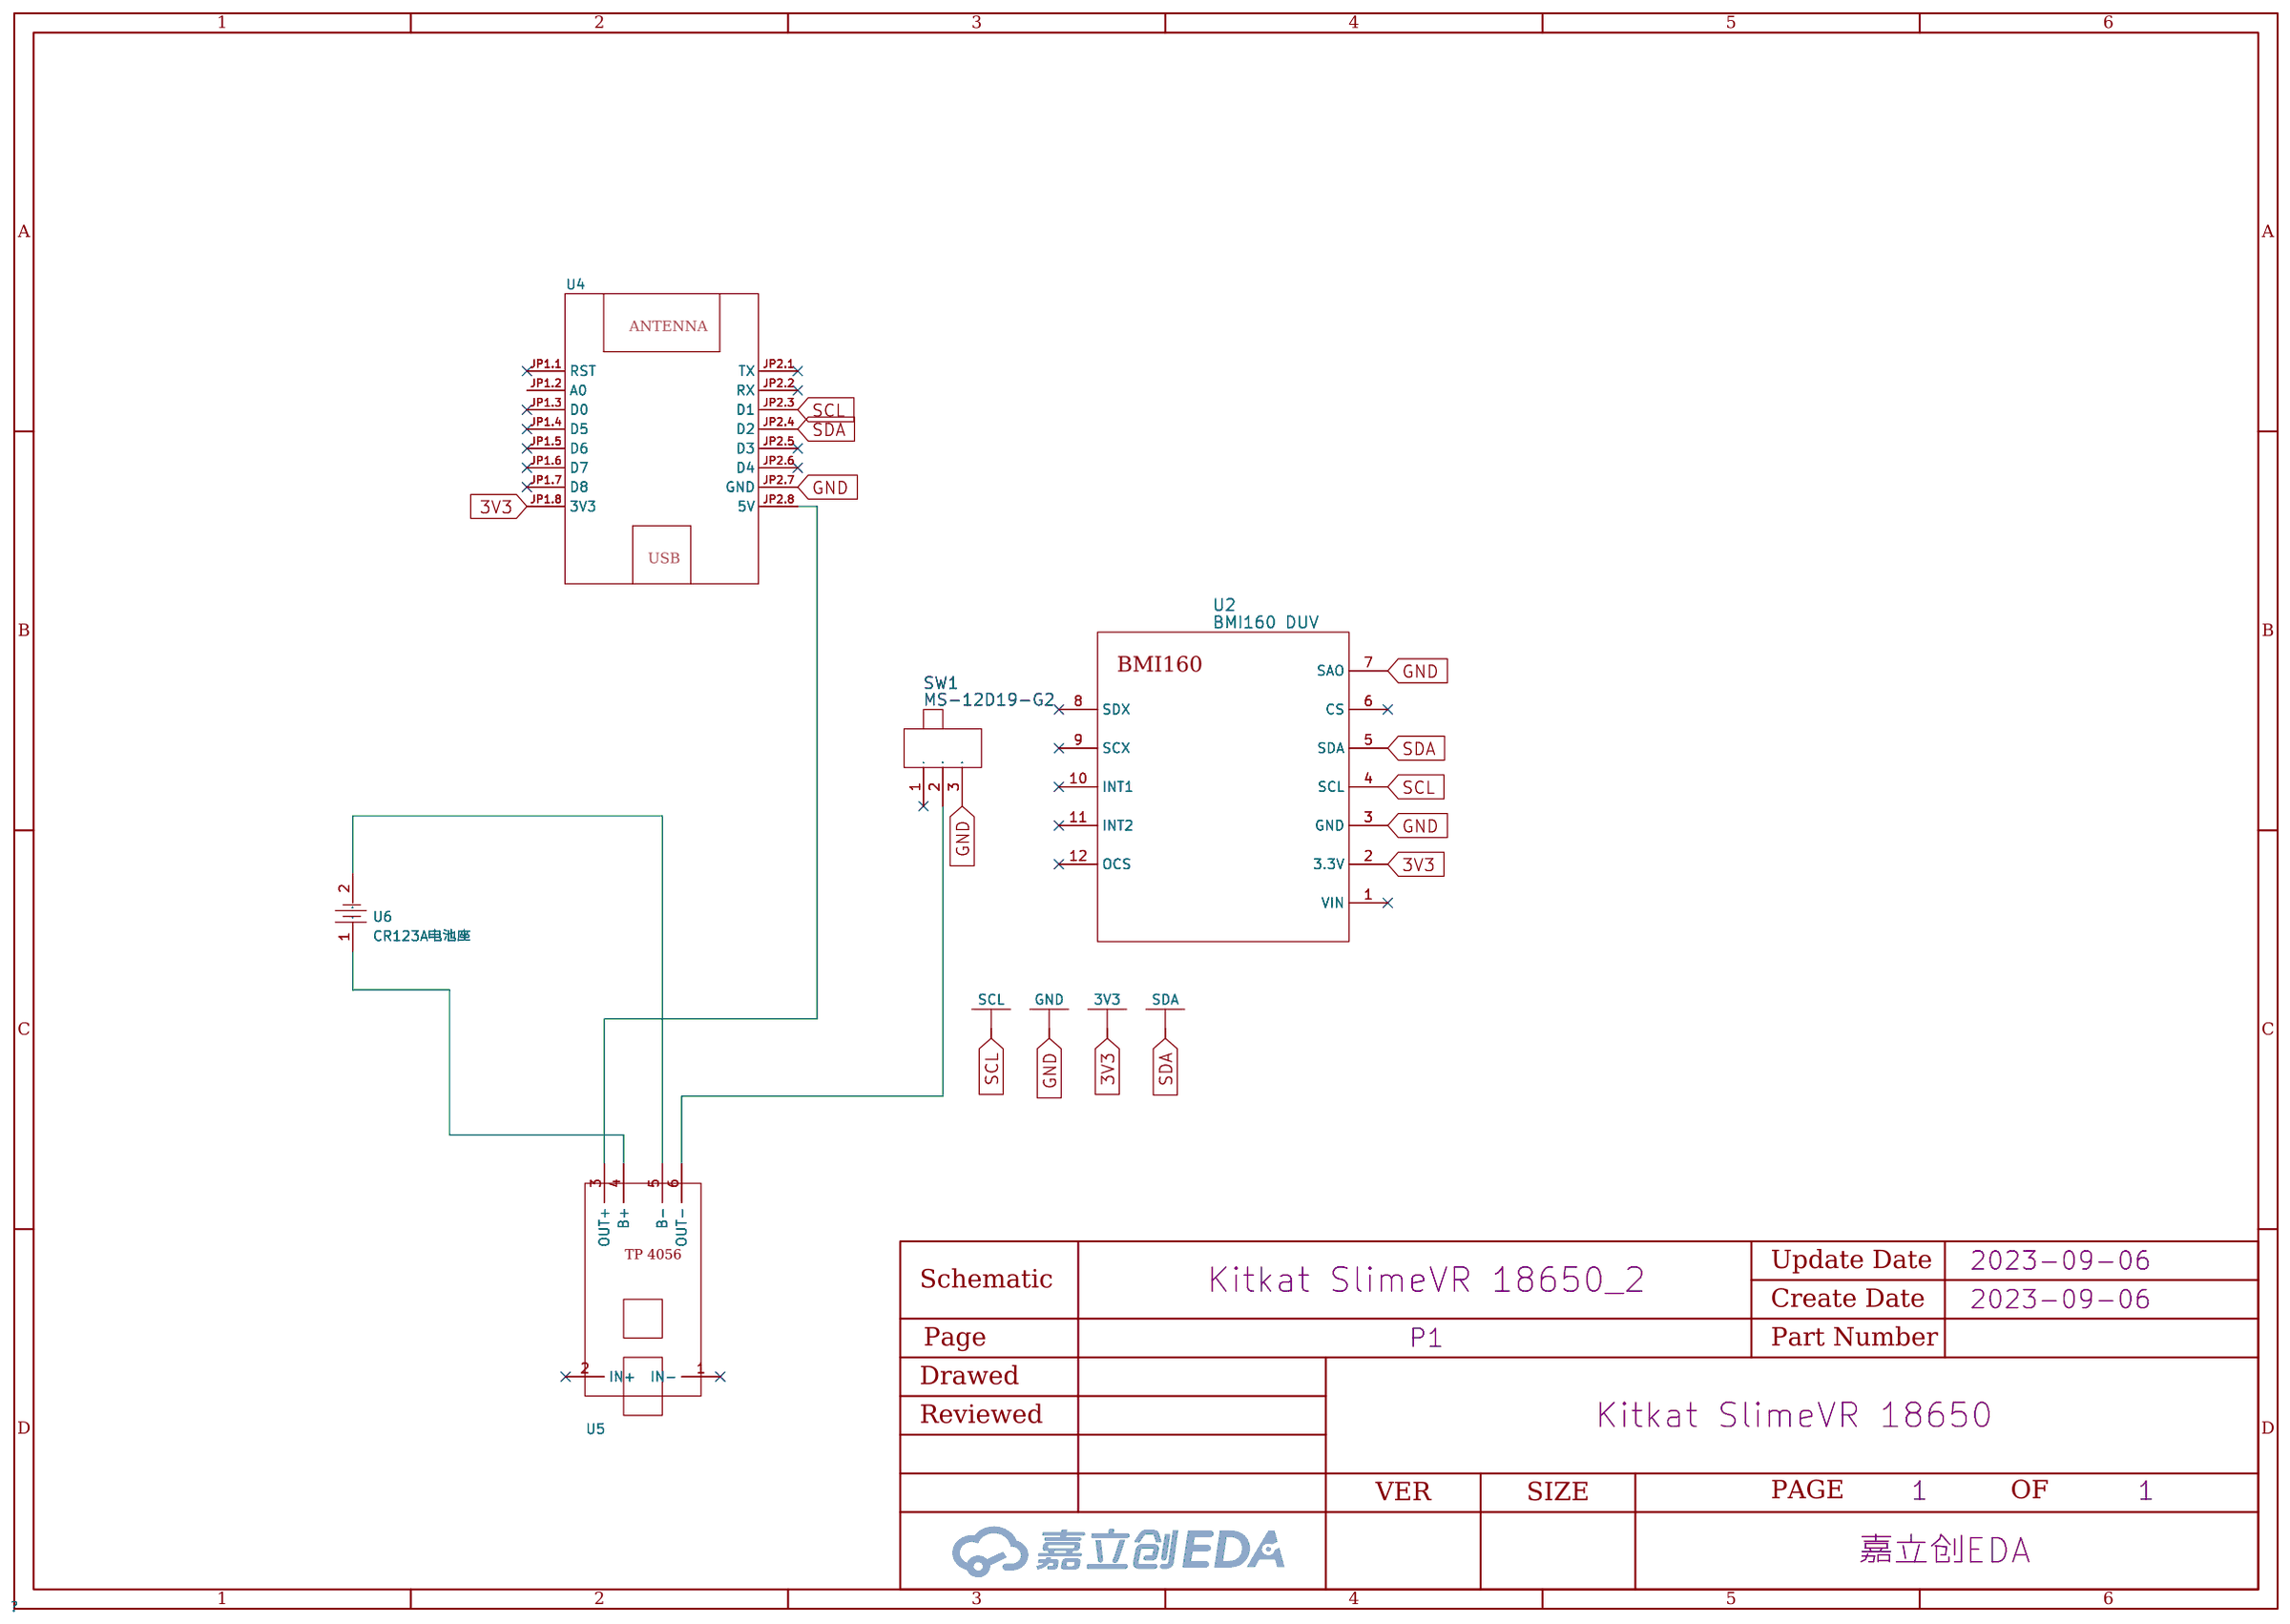
[diagram p7: schematic sheet]

## Parts
SW1  MS-12D19-G2  [12d19g开关]
U2  BMI160 DUV  [GY-BMI160 DUV CORRECTED]
U4  -  [D1-MINI]
U5  -  [TP4056]
U6  CR123A电池座  [TH_L43.0-W-18.0-CR123A]

## Library data of the parts
SW1 = MS-12D19-G2: Supplier: LCSC; Supplier Part: C2904913; Manufacturer: DEALON(德艺隆)
U2 = BMI160 DUV
U4 = D1-MINI
U5 = tp4056模块
U6 = CR123A电池座: Supplier Part: C2803347; Supplier Footprint: 插件; JLCPCB Part Class: Extended Part; Supplier: LCSC

## Nets
3V3: U2.2(3.3V) U4.JP1.8(3V3)
GND: SW1.3 U2.3(GND) U2.7(SAO) U4.JP2.7(GND)
SCL: U2.4(SCL) U4.JP2.3(D1)
SDA: U2.5(SDA) U4.JP2.4(D2)
$1N942: SW1.2 U5.6(OUT-)
$1N945: U5.4(B+) U6.1
$1N1593: U4.JP2.8(5V) U5.3(OUT+)
$1N2023: U5.5(B-) U6.2

Not connected (* = marked no-connect by the designer): SW1 1*; U2 1(VIN)* 6(CS)* 8(SDX)* 9(SCX)* 10(INT1)* 11(INT2)* 12(OCS)*; U4 JP1.1(RST)* JP1.2(A0) JP1.3(D0)* JP1.4(D5)* JP1.5(D6)* JP1.6(D7)* JP1.7(D8)* JP2.1(TX)* JP2.2(RX)* JP2.5(D3)* JP2.6(D4)*; U5 1(IN-)* 2(IN+)*

# Schematic Kitkat SlimeVR 18650_3
Create Date: 2023-10-01; Page Name: P1; Project Name: Kitkat SlimeVR 18650; Schematic Name: Kitkat SlimeVR 18650_3; Update Date: 2023-10-01; Company: 嘉立创EDA
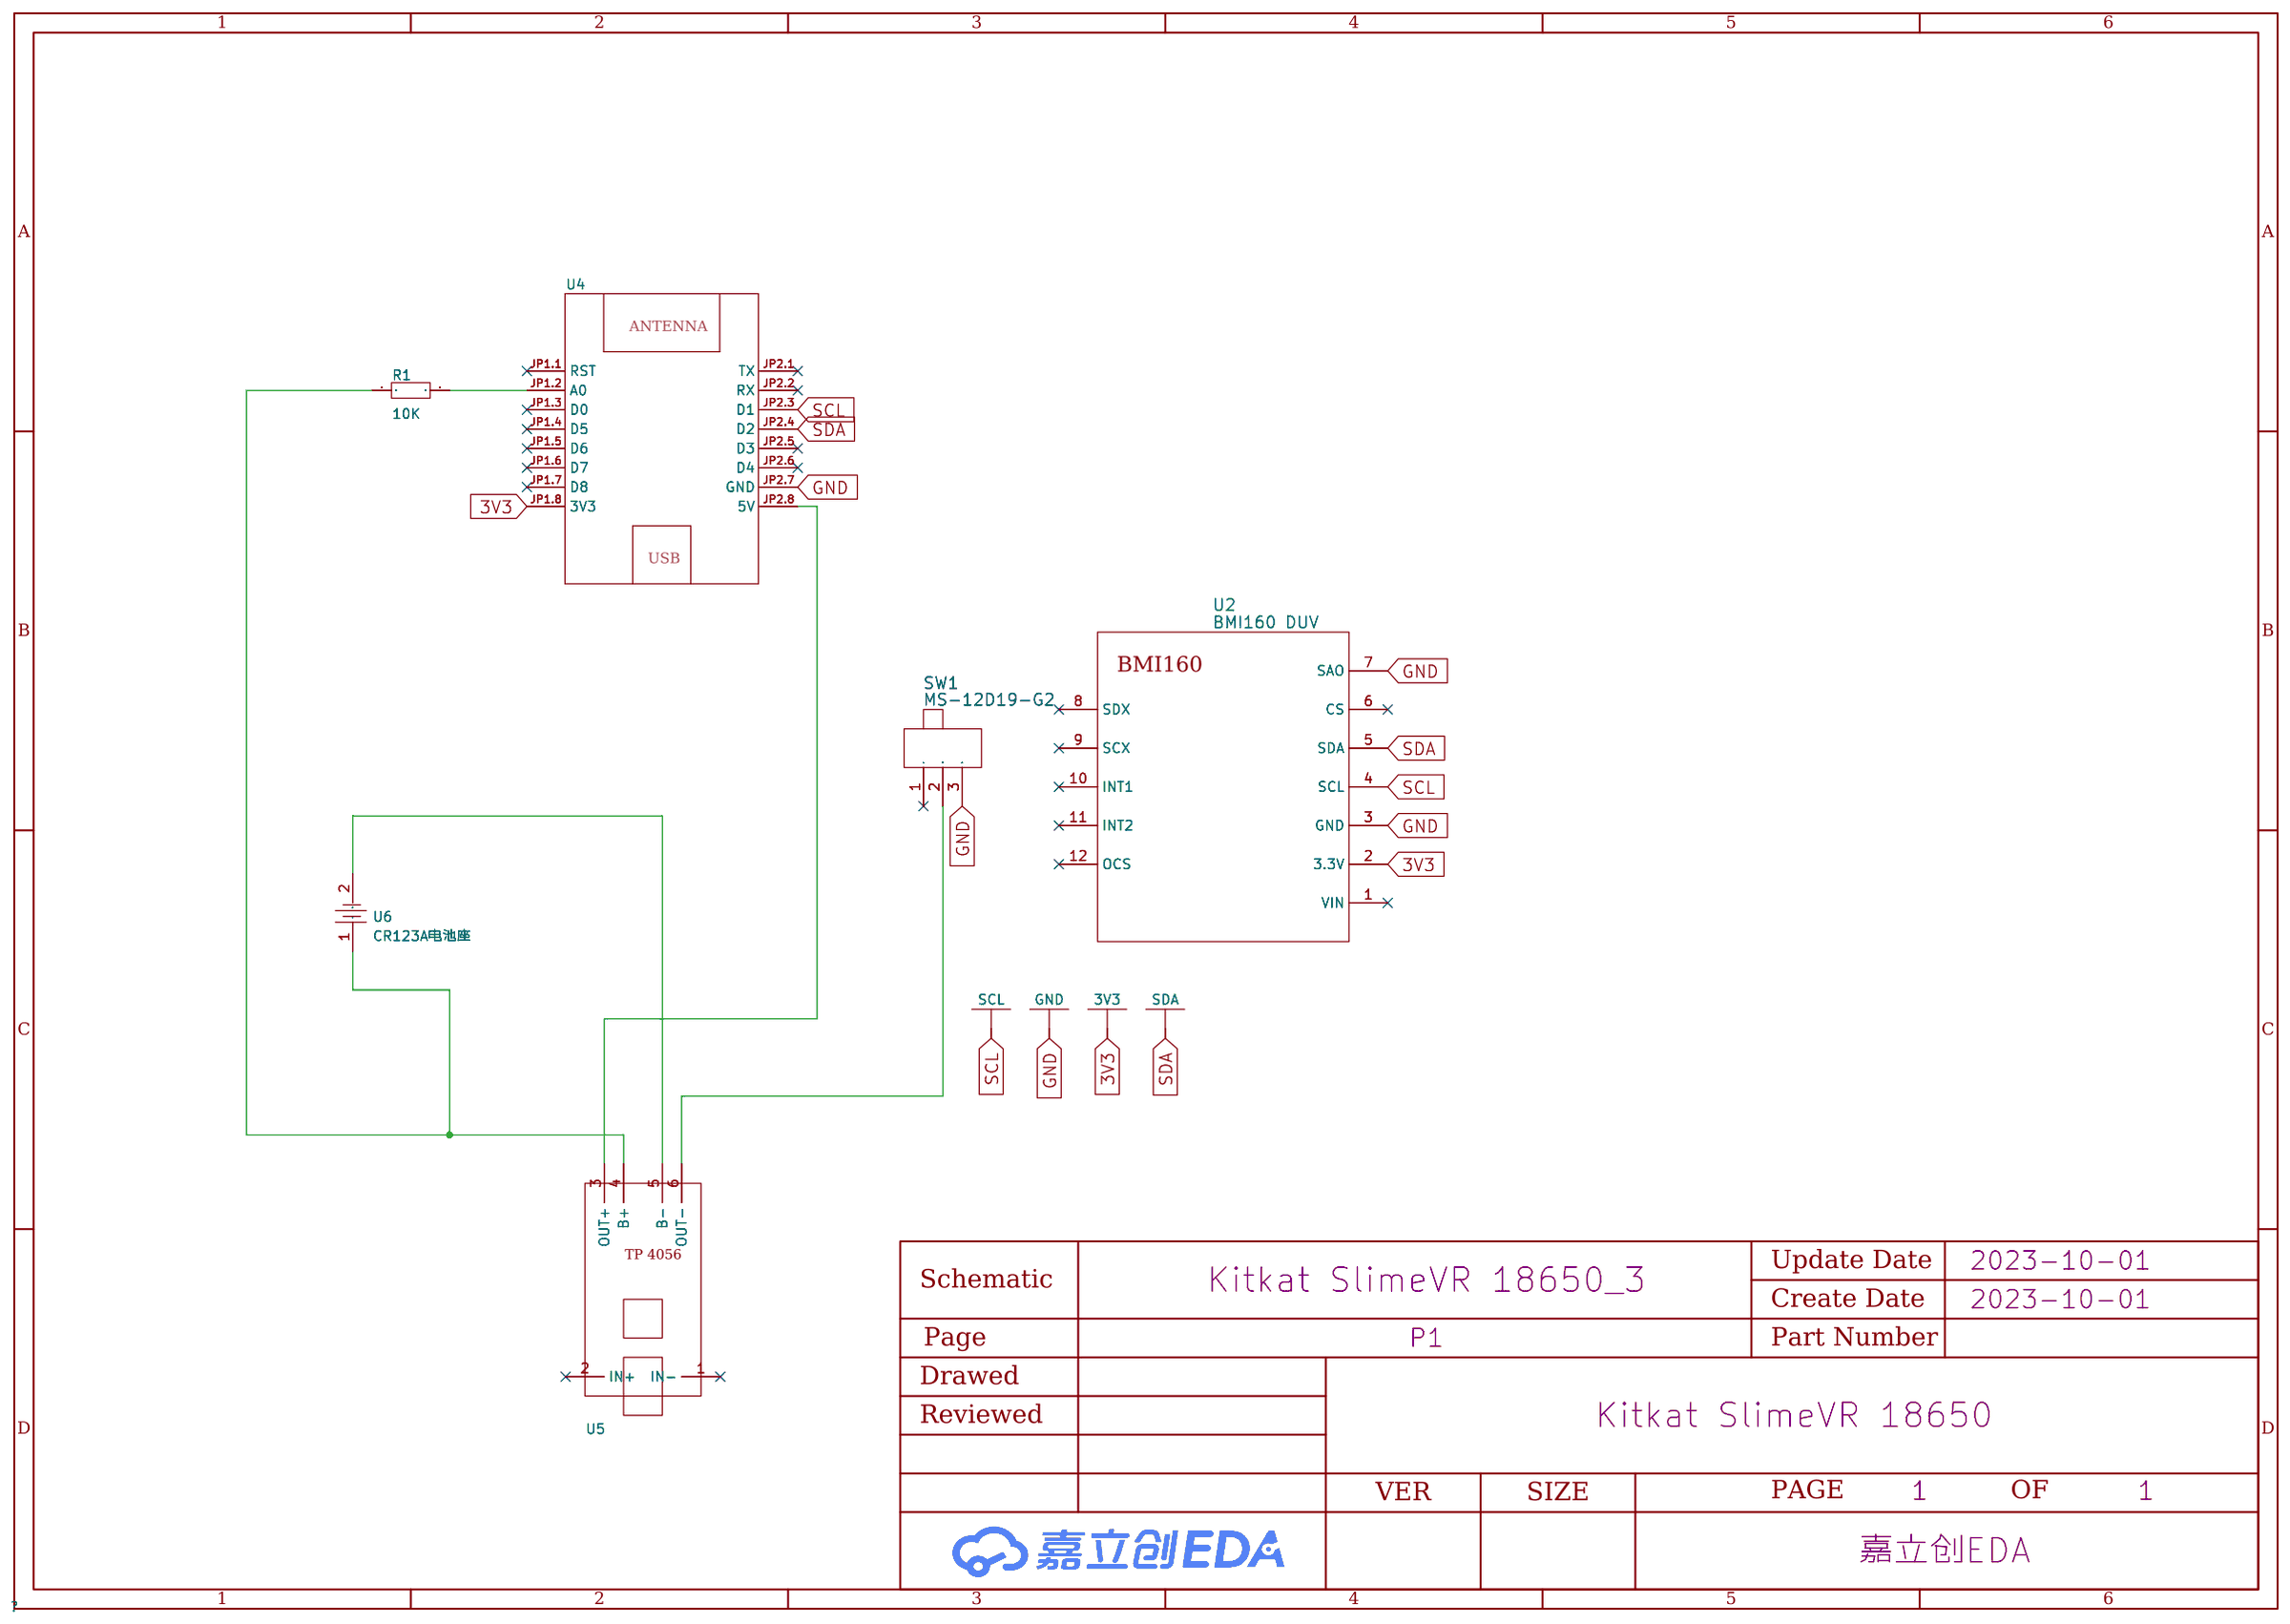
[diagram p8: schematic sheet]

## Parts
R1  10K  [R0805]
SW1  MS-12D19-G2  [12d19g开关]
U2  BMI160 DUV  [GY-BMI160 DUV CORRECTED]
U4  -  [D1-MINI]
U5  -  [TP4056]
U6  CR123A电池座  [TH_L43.0-W-18.0-CR123A]

## Library data of the parts
R1 = Res_0805: Supplier Footprint: 0805
SW1 = MS-12D19-G2: Supplier: LCSC; Supplier Part: C2904913; Manufacturer: DEALON(德艺隆)
U2 = BMI160 DUV
U4 = D1-MINI
U5 = tp4056模块
U6 = CR123A电池座: Supplier Part: C2803347; Supplier Footprint: 插件; JLCPCB Part Class: Extended Part; Supplier: LCSC

## Nets
3V3: U2.2(3.3V) U4.JP1.8(3V3)
GND: SW1.3 U2.3(GND) U2.7(SAO) U4.JP2.7(GND)
SCL: U2.4(SCL) U4.JP2.3(D1)
SDA: U2.5(SDA) U4.JP2.4(D2)
$1N942: SW1.2 U5.6(OUT-)
$1N1593: U4.JP2.8(5V) U5.3(OUT+)
$1N2023: U5.5(B-) U6.2
$1N2545: R1.2 U4.JP1.2(A0)
$1N2548: R1.1 U5.4(B+) U6.1

Not connected (* = marked no-connect by the designer): SW1 1*; U2 1(VIN)* 6(CS)* 8(SDX)* 9(SCX)* 10(INT1)* 11(INT2)* 12(OCS)*; U4 JP1.1(RST)* JP1.3(D0)* JP1.4(D5)* JP1.5(D6)* JP1.6(D7)* JP1.7(D8)* JP2.1(TX)* JP2.2(RX)* JP2.5(D3)* JP2.6(D4)*; U5 1(IN-)* 2(IN+)*

# Schematic Kitkat SlimeVR 18650_4
Create Date: 2023-10-15; Page Name: P1; Project Name: SlimeVR AceStacks 16340; Schematic Name: Kitkat SlimeVR 18650_4; Update Date: 2023-10-14; Company: 嘉立创EDA
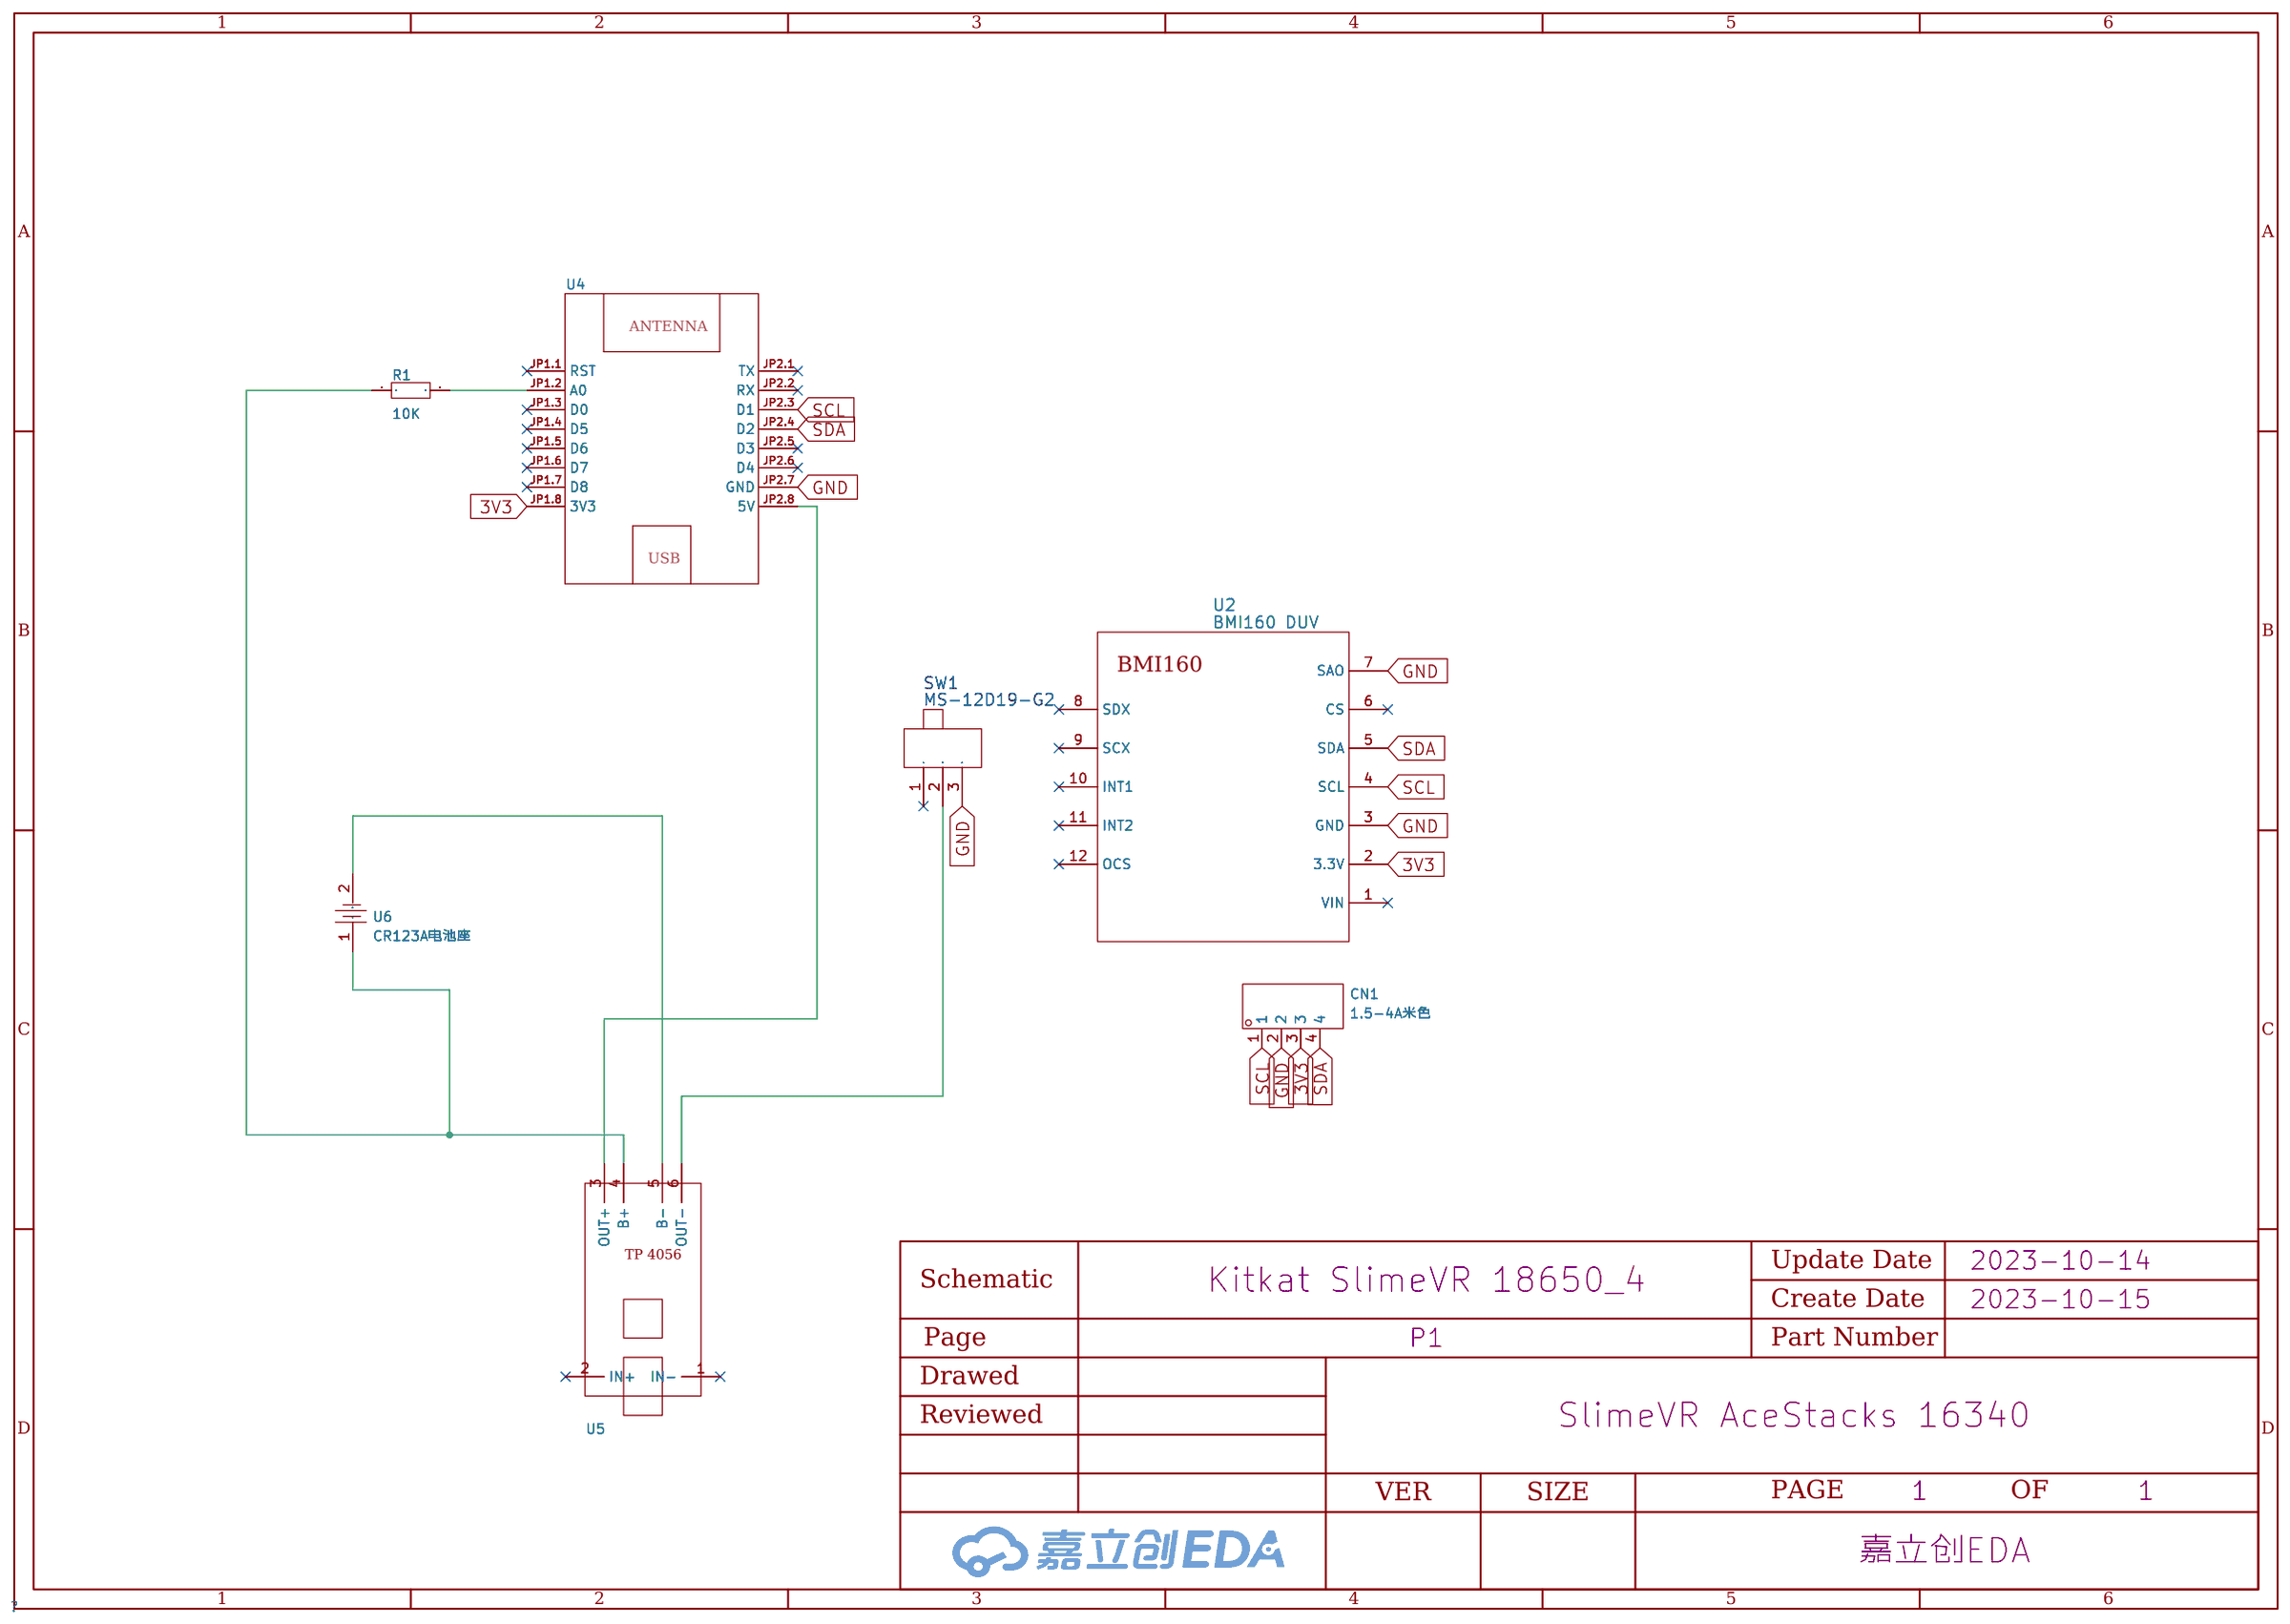
[diagram p9: schematic sheet]

## Parts
CN1  1.5-4A米色  [CONN-TH_4P-P1.50_ZH1.5-4A]
R1  10K  [R0805]
SW1  MS-12D19-G2  [12d19g开关]
U2  BMI160 DUV  [GY-BMI160 DUV CORRECTED]
U4  -  [D1-MINI]
U5  -  [TP4056]
U6  CR123A电池座  [TH_L43.0-W-18.0-CR123A]

## Library data of the parts
CN1 = 1.5-4A米色: Reference Series:ZH Pitch:1.5mm Pins Structure:1x4P Number of Rows:1 Number of PINs Per Row:4 Row Spacing:- Mounting Style:- Contact Material:-; LCSC Part Name: ZH 1.5mm 1x4P; Supplier Part: C146011; Manufacturer: BOOMELE(博穆精密); Supplier Footprint: 插件,P=1.5mm; JLCPCB Part Class: Extended Part; Datasheet: https://atta.szlcsc.com/upload/public/pdf/source/20171115/C146011_15107293658451120495.pdf; Supplier: LCSC; Reference Series: ZH; Pitch: 1.5mm; Pins Structure: 1x4P; Number of Rows: 1; Number of PINs Per Row: 4
R1 = Res_0805: Supplier Footprint: 0805
SW1 = MS-12D19-G2: Supplier: LCSC; Supplier Part: C2904913; Manufacturer: DEALON(德艺隆)
U2 = BMI160 DUV
U4 = D1-MINI
U5 = tp4056模块
U6 = CR123A电池座: Supplier Part: C2803347; Supplier Footprint: 插件; JLCPCB Part Class: Extended Part; Supplier: LCSC

## Nets
3V3: CN1.3 U2.2(3.3V) U4.JP1.8(3V3)
GND: CN1.2 SW1.3 U2.3(GND) U2.7(SAO) U4.JP2.7(GND)
SCL: CN1.1 U2.4(SCL) U4.JP2.3(D1)
SDA: CN1.4 U2.5(SDA) U4.JP2.4(D2)
$1N942: SW1.2 U5.6(OUT-)
$1N1593: U4.JP2.8(5V) U5.3(OUT+)
$1N2023: U5.5(B-) U6.2
$1N2545: R1.2 U4.JP1.2(A0)
$1N2548: R1.1 U5.4(B+) U6.1

Not connected (* = marked no-connect by the designer): SW1 1*; U2 1(VIN)* 6(CS)* 8(SDX)* 9(SCX)* 10(INT1)* 11(INT2)* 12(OCS)*; U4 JP1.1(RST)* JP1.3(D0)* JP1.4(D5)* JP1.5(D6)* JP1.6(D7)* JP1.7(D8)* JP2.1(TX)* JP2.2(RX)* JP2.5(D3)* JP2.6(D4)*; U5 1(IN-)* 2(IN+)*

# Schematic Schematic1
Create Date: 2023-08-22; Page Name: P1; Project Name: Kitkat SlimeVR 18650; Schematic Name: Schematic1; Update Date: 2023-08-22; Company: EasyEDA.com; Drawed: EasyEDA Pro; Page Size: A4; Part Number: JLCPCB-002; Reviewed: EasyEDA Pro; Version: V0.1
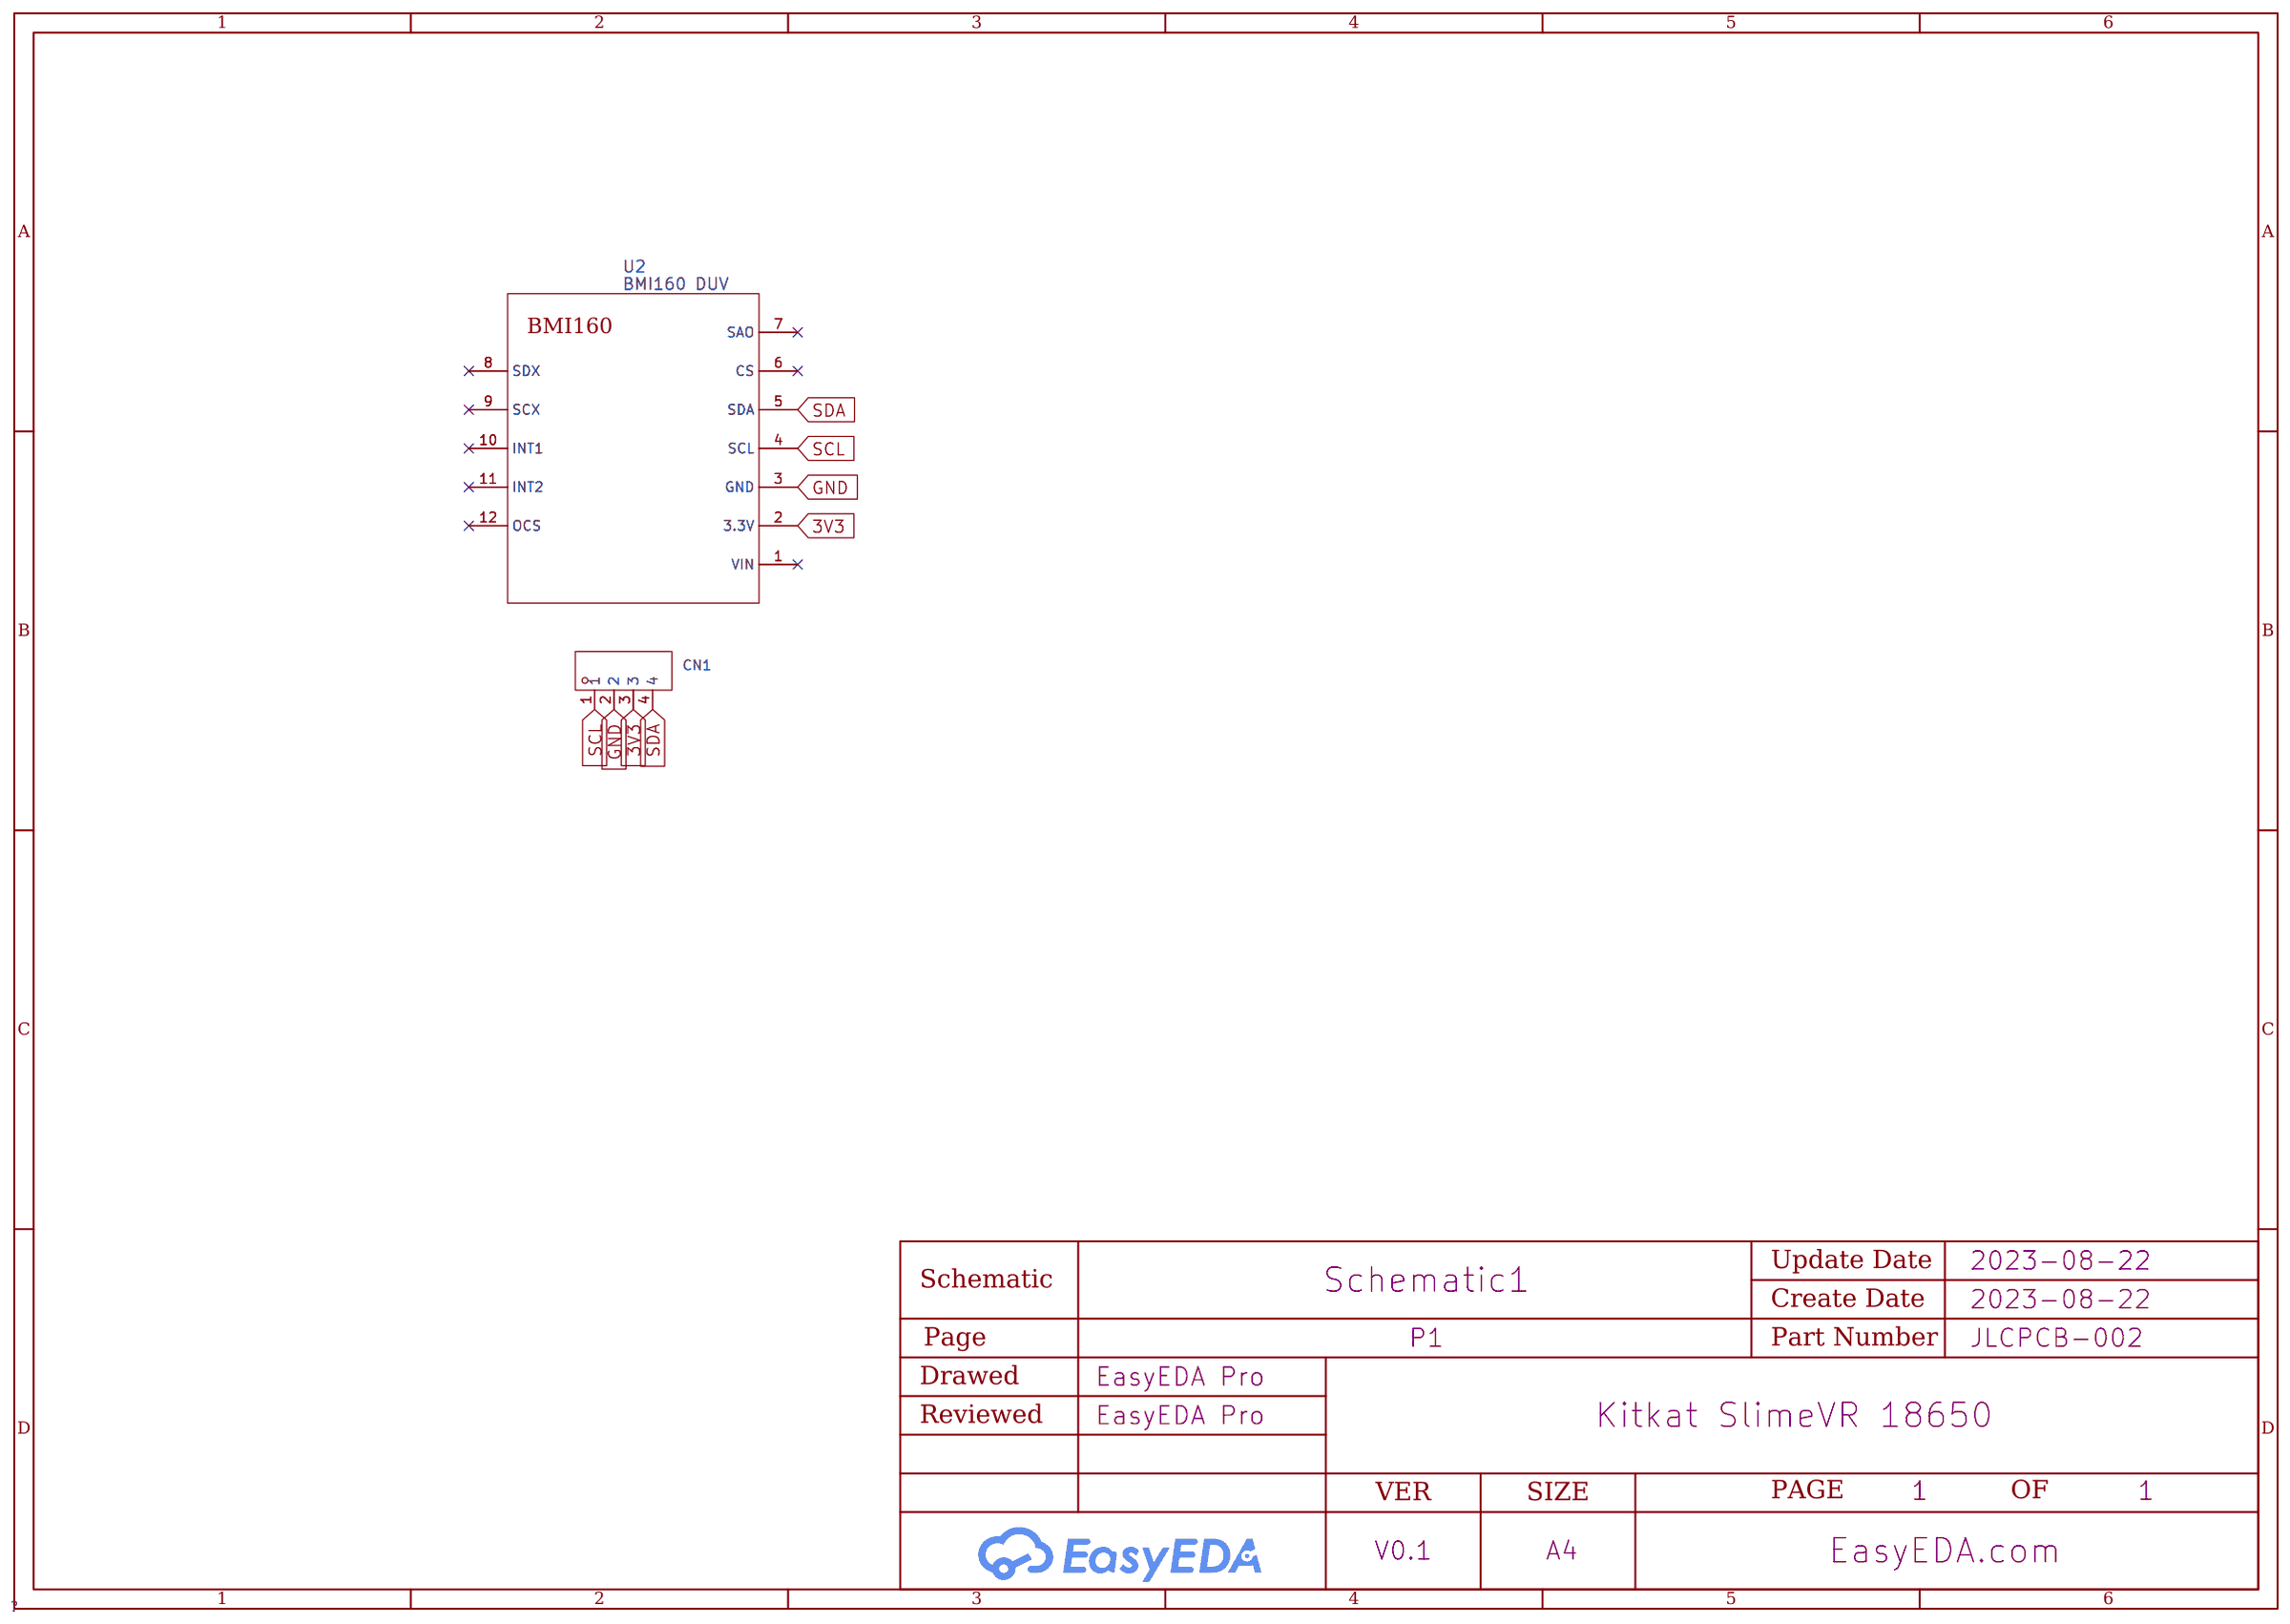
[diagram p10: schematic sheet]

## Parts
CN1  -  [CONN-TH_4P-P2.00_KINGHELM_KH-PH-4P-W]
U2  BMI160 DUV  [GY-BMI160 DUV CORRECTED]

## Library data of the parts
CN1 = PH2.00-4P-立贴: Supplier Part: C146095; Manufacturer: BOOMELE(博穆精密); Manufacturer Part: PH-4AW米; LCSC On Sale: 1; Supplier Footprint: 卧插 P=2mm; JLCPCB Part Class: Extended Part; JLCPCB Stock Number: 4500; Datasheet: https://atta.szlcsc.com/upload/public/pdf/source/20171115/C146095_15107294042951120572.pdf; Supplier: LCSC; Number of Positions: 4; Connector Type: 针座; Number of Rows: 1; Mounting Type: 通孔,直角; Contact Type: 公形引脚; Pitch: 0.079; Series: PH
U2 = BMI160 DUV

## Nets
3V3: CN1.3 U2.2(3.3V)
GND: CN1.2 U2.3(GND)
SCL: CN1.1 U2.4(SCL)
SDA: CN1.4 U2.5(SDA)

Not connected (* = marked no-connect by the designer): U2 1(VIN)* 6(CS)* 7(SAO)* 8(SDX)* 9(SCX)* 10(INT1)* 11(INT2)* 12(OCS)*
